# EAGLE design EspressoCircuitry (EAGLE 9.0.1)

## Sheet 1 of 3: Power and Embedded Control
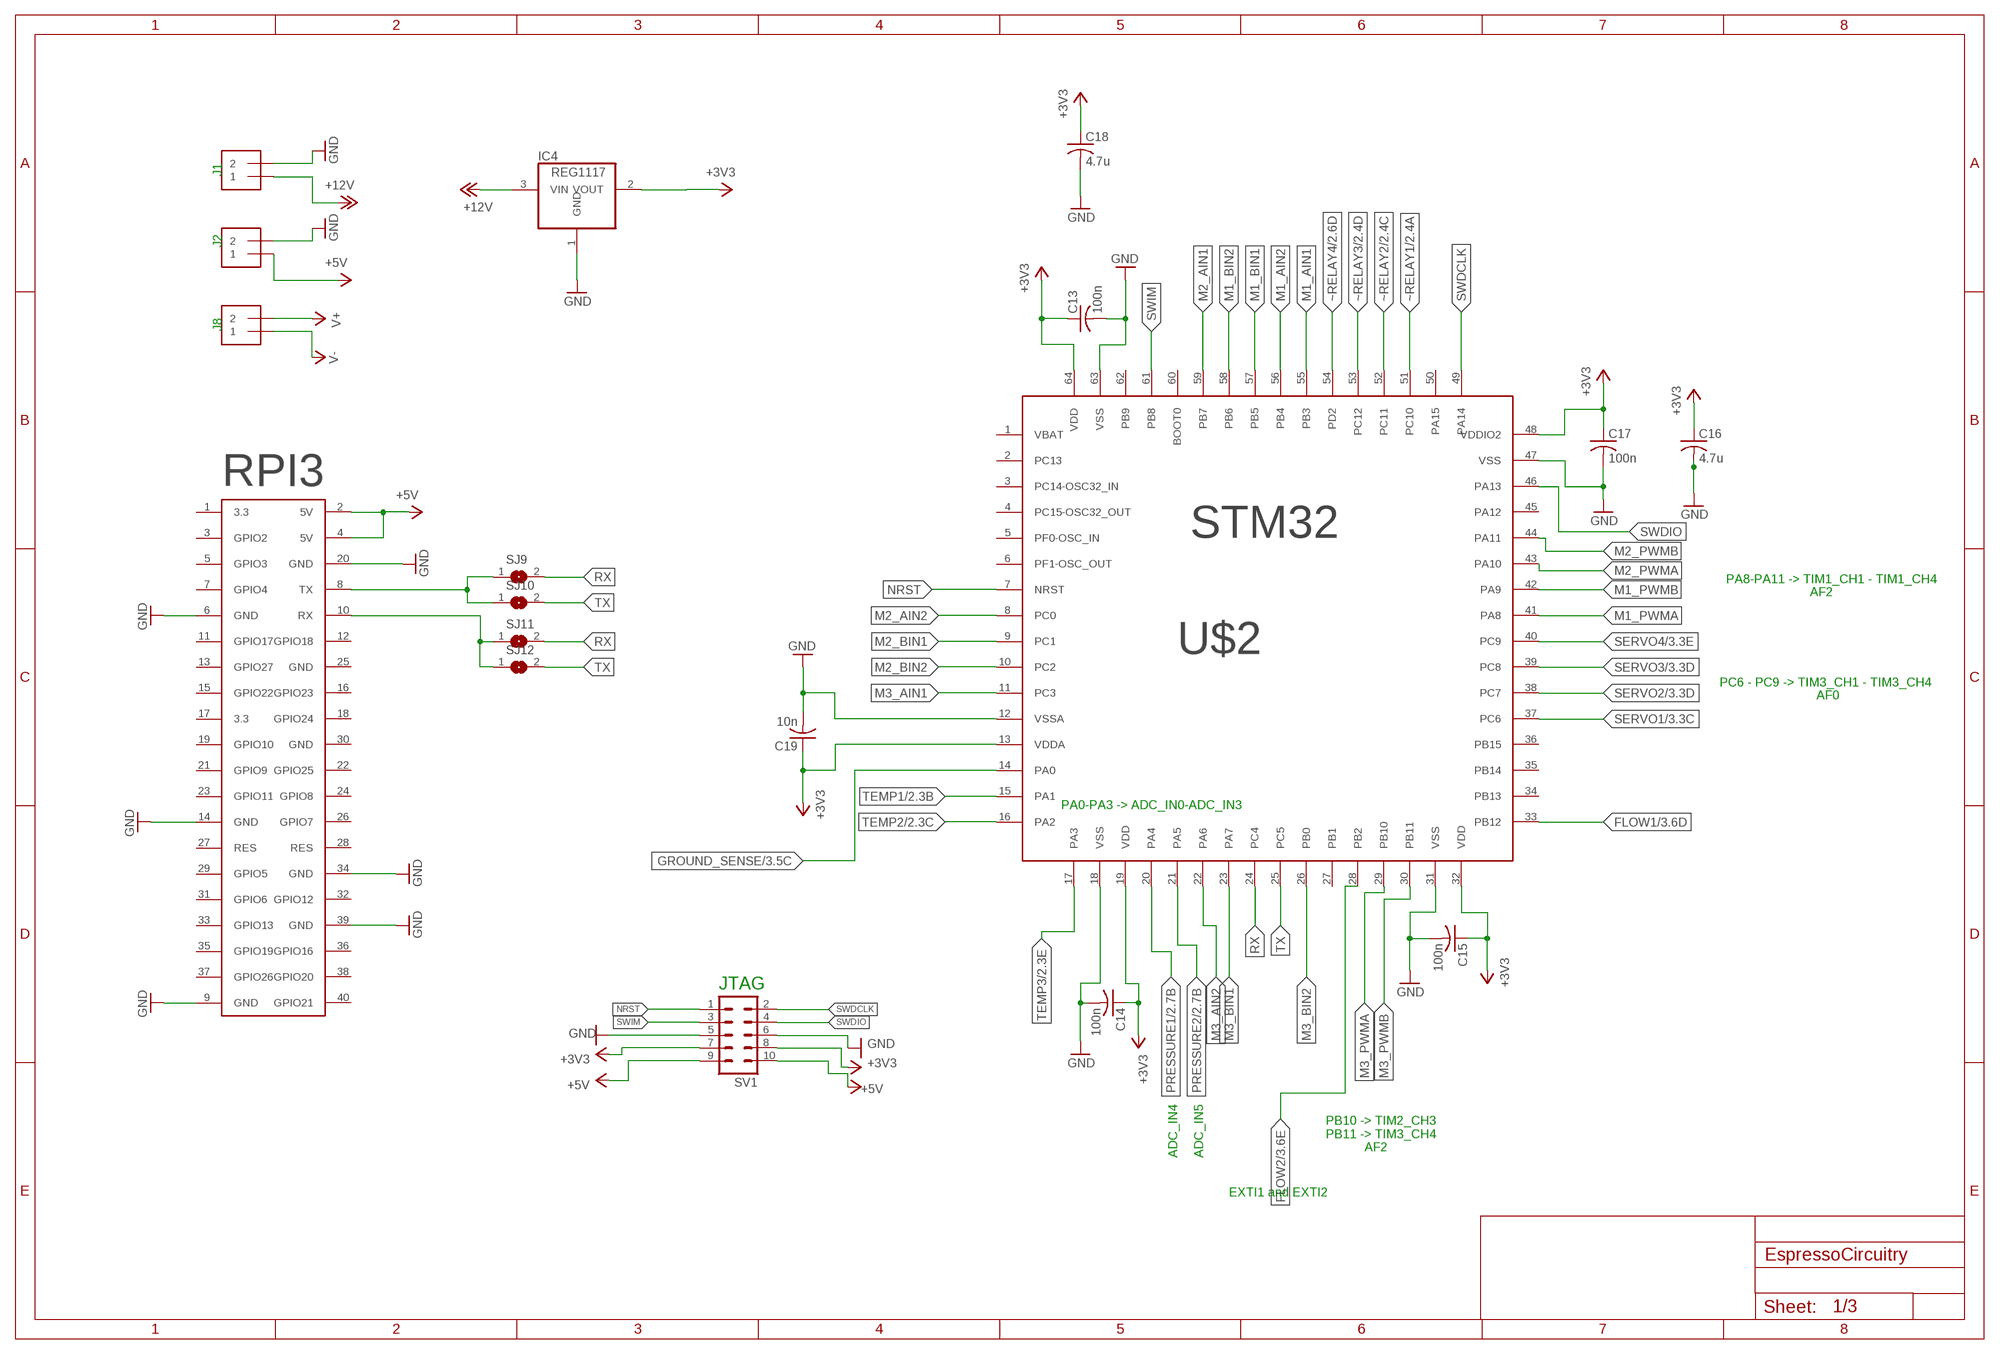
[diagram p0: schematic, sheet 1]

### Parts
C13  100n  C-USC0603  [C0603]
C14  100n  C-USC0603  [C0603]
C15  100n  C-USC0603  [C0603]
C16  4.7u  C-USC0603  [C0603]
C17  100n  C-USC0603  [C0603]
C18  4.7u  C-USC0603  [C0603]
C19  10n  C-USC0603  [C0603]
IC4  REG1117  [SOT223]
J1  1X2-3.5MM  [1X2-3.5MM]
J2  1X2-3.5MM  [1X2-3.5MM]
J8  1X2-3.5MM  [1X2-3.5MM]
SJ9  SJ  [SJ]
SJ10  SJ  [SJ]
SJ11  SJ  [SJ]
SJ12  SJ  [SJ]
SV1  MA05-2  [MA05-2]
U$1  RPI  [FE20-2]
U$2  STM32F072RBT6LGFP64  [PLQFP64-1]

### Nets
+3V3: C13.1 C14.1 C15.1 C16.1 C17.1 C18.1 C19.1 IC4.2(VOUT) SV1.7 SV1.8 U$2.13(VDDA) U$2.19(VDD) U$2.32(VDD) U$2.48(VDDIO2) U$2.64(VDD) ; also sheet 2,3
+5V: J2.1 SV1.9 SV1.10 U$1.2(5V) U$1.4(5V) ; also sheet 2,3
+12V: IC4.3(VIN) J1.1 ; also sheet 2,3
FLOW1: U$2.33(PB12) ; also sheet 3
FLOW2: U$2.28(PB2) ; also sheet 3
GND: C13.2 C14.2 C15.2 C16.2 C17.2 C18.2 C19.2 IC4.1(GND) J1.2 J2.2 SV1.5 SV1.6 U$1.6(GND) U$1.9(GND) U$1.14(GND) U$1.20(GND) U$1.34(GND) U$1.39(GND) U$2.12(VSSA) U$2.18(VSS) U$2.31(VSS) U$2.47(VSS) U$2.63(VSS) ; also sheet 2,3
GROUND_SENSE: U$2.14(PA0) ; also sheet 3
M1_AIN1: U$2.55(PB3) ; also sheet 3
M1_AIN2: U$2.56(PB4) ; also sheet 3
M1_BIN1: U$2.57(PB5) ; also sheet 3
M1_BIN2: U$2.58(PB6) ; also sheet 3
M1_PWMA: U$2.41(PA8) ; also sheet 3
M1_PWMB: U$2.42(PA9) ; also sheet 3
M2_AIN1: U$2.59(PB7) ; also sheet 3
M2_AIN2: U$2.8(PC0) ; also sheet 3
M2_BIN1: U$2.9(PC1) ; also sheet 3
M2_BIN2: U$2.10(PC2) ; also sheet 3
M2_PWMA: U$2.43(PA10) ; also sheet 3
M2_PWMB: U$2.44(PA11) ; also sheet 3
M3_AIN1: U$2.11(PC3) ; also sheet 3
M3_AIN2: U$2.22(PA6) ; also sheet 3
M3_BIN1: U$2.23(PA7) ; also sheet 3
M3_BIN2: U$2.26(PB0) ; also sheet 3
M3_PWMA: U$2.29(PB10) ; also sheet 3
M3_PWMB: U$2.30(PB11) ; also sheet 3
N$1: SJ9.1 SJ10.1 U$1.8(TX)
N$48: SJ11.1 SJ12.1 U$1.10(RX)
NRST: SV1.1 U$2.7(NRST)
PRESSURE1: U$2.20(PA4) ; also sheet 2
PRESSURE2: U$2.21(PA5) ; also sheet 2
RX: SJ9.2 SJ11.2 U$2.24(PC4)
SERVO1: U$2.37(PC6) ; also sheet 3
SERVO2: U$2.38(PC7) ; also sheet 3
SERVO3: U$2.39(PC8) ; also sheet 3
SERVO4: U$2.40(PC9) ; also sheet 3
SWDCLK: SV1.2 U$2.49(PA14)
SWDIO: SV1.4 U$2.46(PA13)
SWIM: SV1.3 U$2.61(PB8)
TEMP1: U$2.15(PA1) ; also sheet 2
TEMP2: U$2.16(PA2) ; also sheet 2
TEMP3: U$2.17(PA3) ; also sheet 2
TX: SJ10.2 SJ12.2 U$2.25(PC5)
V+: J8.2 ; also sheet 2
V-: J8.1 ; also sheet 2
~RELAY1: U$2.51(PC10) ; also sheet 2
~RELAY2: U$2.52(PC11) ; also sheet 2
~RELAY3: U$2.53(PC12) ; also sheet 2
~RELAY4: U$2.54(PD2) ; also sheet 2
Unconnected: U$1.1(3.3) U$1.3(GPIO2) U$1.5(GPIO3) U$1.7(GPIO4) U$1.11(GPIO17) U$1.12(GPIO18) U$1.13(GPIO27) U$1.15(GPIO22) U$1.16(GPIO23) U$1.17(3.3) U$1.18(GPIO24) U$1.19(GPIO10) U$1.21(GPIO9) U$1.22(GPIO25) U$1.23(GPIO11) U$1.24(GPIO8) U$1.25(GND) U$1.26(GPIO7) U$1.27(RES) U$1.28(RES) U$1.29(GPIO5) U$1.30(GND) U$1.31(GPIO6) U$1.32(GPIO12) U$1.33(GPIO13) U$1.35(GPIO19) U$1.36(GPIO16) U$1.37(GPIO26) U$1.38(GPIO20) U$1.40(GPIO21) U$2.1(VBAT) U$2.2(PC13) U$2.3(PC14-OSC32_IN) U$2.4(PC15-OSC32_OUT) U$2.5(PF0-OSC_IN) U$2.6(PF1-OSC_OUT) U$2.27(PB1) U$2.34(PB13) U$2.35(PB14) U$2.36(PB15) U$2.45(PA12) U$2.50(PA15) U$2.60(BOOT0) U$2.62(PB9)

### Notes on the sheet
- J1
- J2
- J8
- PA8-PA11 -> TIM1_CH1 - TIM1_CH4
- AF2
- PC6 - PC9 -> TIM3_CH1 - TIM3_CH4
- AF0
- PA0-PA3 -> ADC_IN0-ADC_IN3
- JTAG
- PB10 -> TIM2_CH3
  PB11 -> TIM3_CH4
- AF2
- ADC_IN4 | ADC_IN5
- EXTI1 and EXTI2

## Sheet 2 of 3: Thermal Management
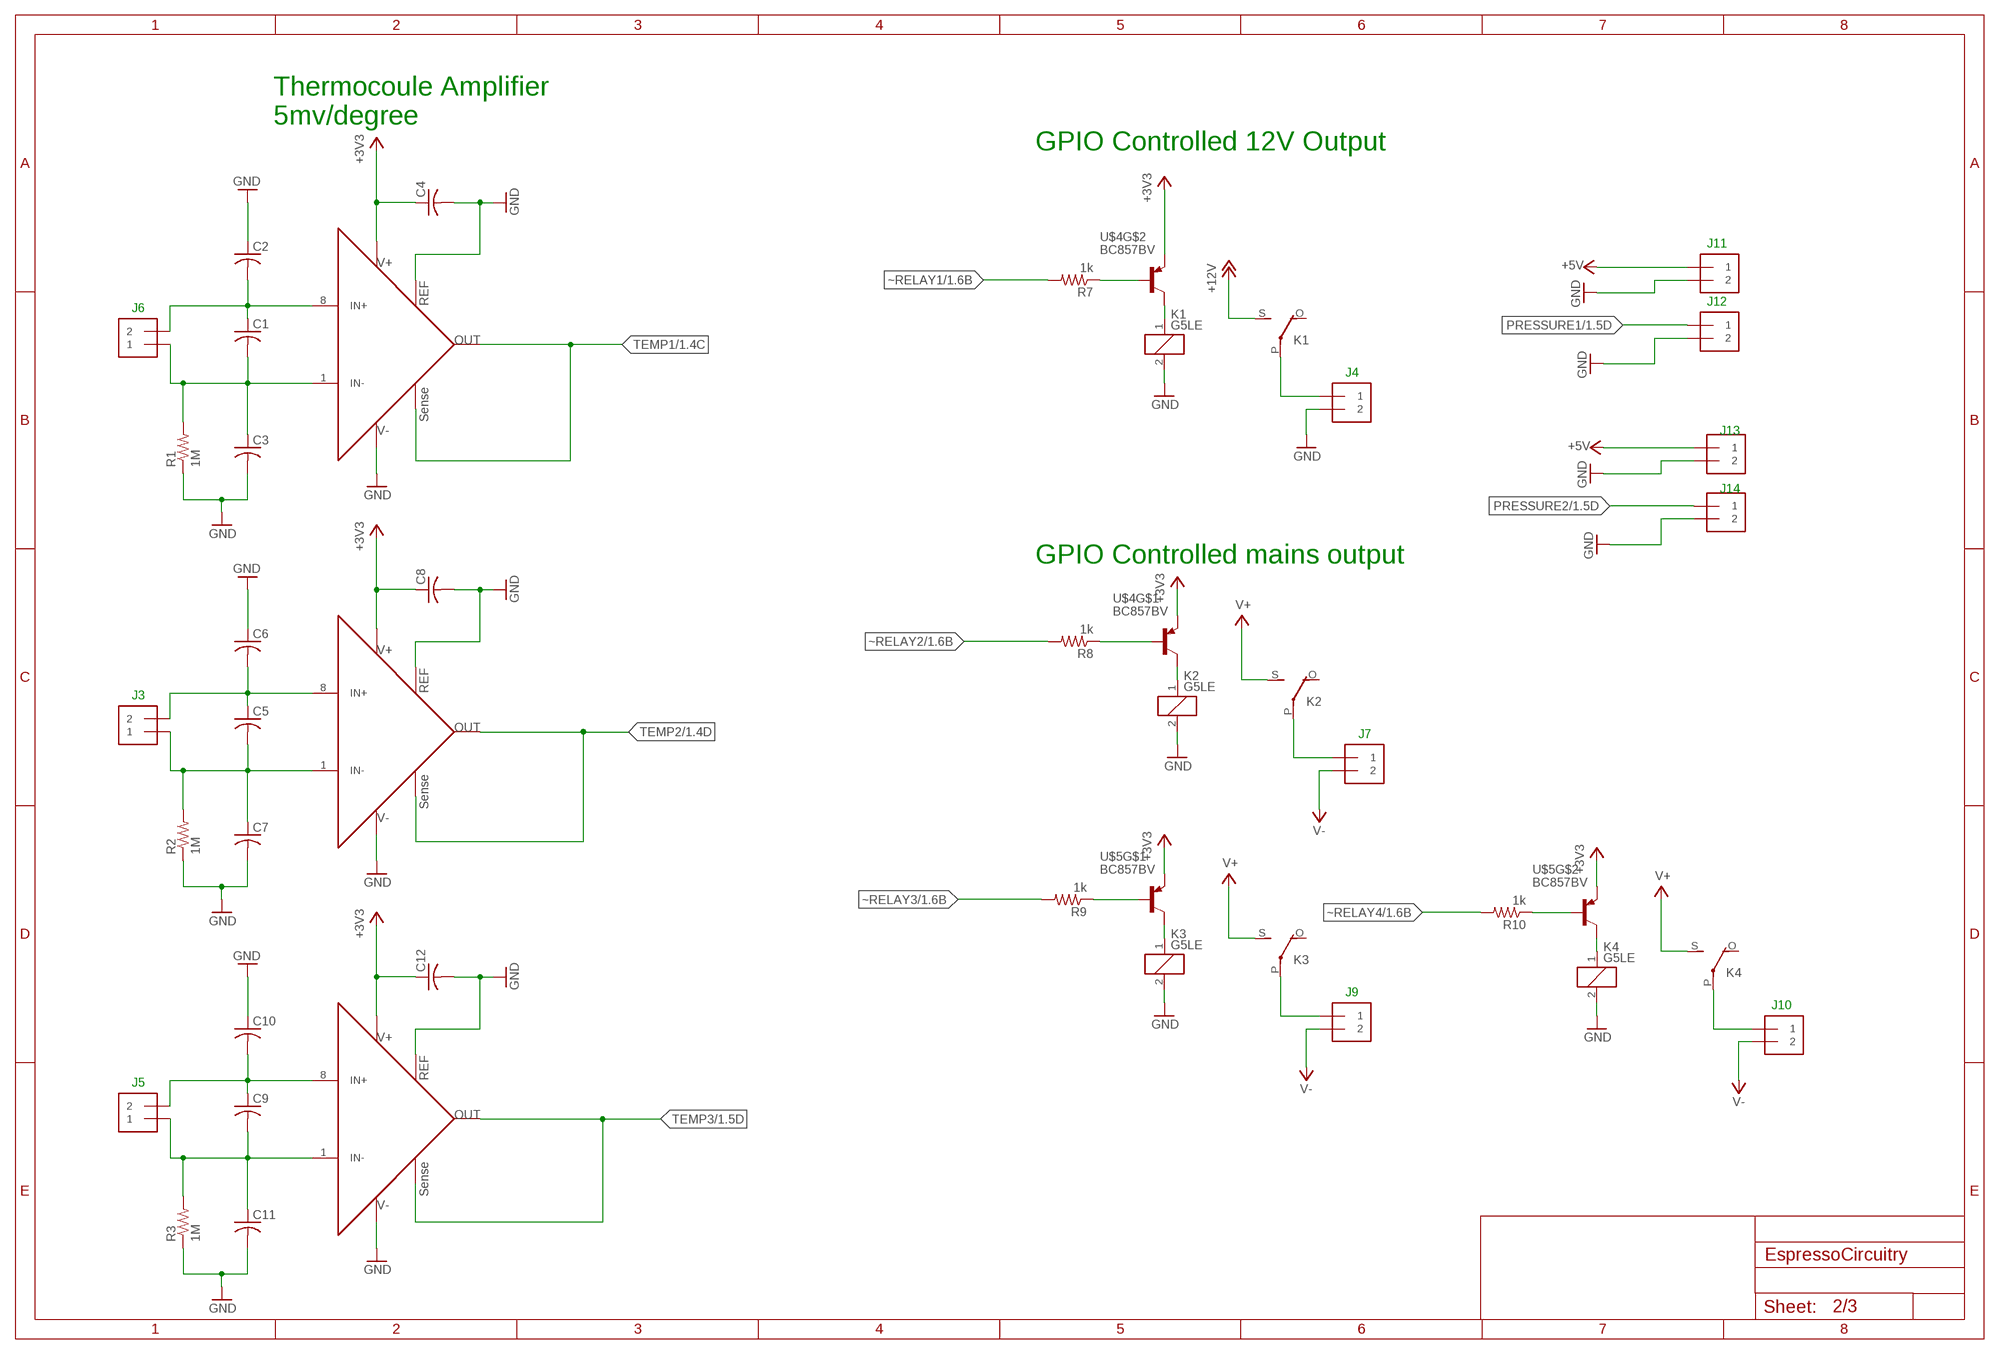
[diagram p1: schematic, sheet 2]

### Parts
C1  C-USC0603  [C0603]
C2  C-USC0603  [C0603]
C3  C-USC0603  [C0603]
C4  C-USC0603  [C0603]
C5  C-USC0603  [C0603]
C6  C-USC0603  [C0603]
C7  C-USC0603  [C0603]
C8  C-USC0603  [C0603]
C9  C-USC0603  [C0603]
C10  C-USC0603  [C0603]
C11  C-USC0603  [C0603]
C12  C-USC0603  [C0603]
J3  1X2-3.5MM  [1X2-3.5MM]
J4  1X2-3.5MM  [1X2-3.5MM]
J5  1X2-3.5MM  [1X2-3.5MM]
J6  1X2-3.5MM  [1X2-3.5MM]
J7  1X2-3.5MM  [1X2-3.5MM]
J9  1X2-3.5MM  [1X2-3.5MM]
J10  1X2-3.5MM  [1X2-3.5MM]
J11  1X2-3.5MM  [1X2-3.5MM]
J12  1X2-3.5MM  [1X2-3.5MM]
J13  1X2-3.5MM  [1X2-3.5MM]
J14  1X2-3.5MM  [1X2-3.5MM]
K1  G5LE  [G5LE]
K2  G5LE  [G5LE]
K3  G5LE  [G5LE]
K4  G5LE  [G5LE]
R1  1M  R-US_R0603  [R0603]
R2  1M  R-US_R0603  [R0603]
R3  1M  R-US_R0603  [R0603]
R7  1k  R-US_R0603  [R0603]
R8  1k  R-US_R0603  [R0603]
R9  1k  R-US_R0603  [R0603]
R10  1k  R-US_R0603  [R0603]
U$3  AD8494  [TSSOP8]
U$4  BC857BV  [SOT-563]
U$5  BC857BV  [SOT-563]
U$6  AD8494  [TSSOP8]
U$7  AD8494  [TSSOP8]

### Nets
+3V3: C4.1 C8.1 C12.1 U$3.7(V+) U$4.P$3(E) U$4.P$6(E) U$5.P$3(E) U$5.P$6(E) U$6.7(V+) U$7.7(V+) ; also sheet 1,3
+5V: J11.1 J13.1 ; also sheet 1,3
+12V: K1.S(2:S) ; also sheet 1,3
GND: C2.1 C3.2 C4.2 C6.1 C7.2 C8.2 C10.1 C11.2 C12.2 J4.2 J11.2 J12.2 J13.2 J14.2 K1.2 K2.2 K3.2 K4.2 R1.1 R2.1 R3.1 U$3.2(REF) U$3.3(V-) U$6.2(REF) U$6.3(V-) U$7.2(REF) U$7.3(V-) ; also sheet 1,3
N$2: J4.1 K1.P(2:P)
N$3: J7.1 K2.P(2:P)
N$4: K1.1 U$4.P$1(C)
N$5: K2.1 U$4.P$4(C)
N$6: C1.1 C2.2 J6.2 U$3.8(IN+)
N$7: C1.2 C3.1 J6.1 R1.2 U$3.1(IN-)
N$8: J9.1 K3.P(2:P)
N$9: K3.1 U$5.P$4(C)
N$10: C5.1 C6.2 J3.2 U$6.8(IN+)
N$11: C5.2 C7.1 J3.1 R2.2 U$6.1(IN-)
N$12: C9.1 C10.2 J5.2 U$7.8(IN+)
N$13: C9.2 C11.1 J5.1 R3.2 U$7.1(IN-)
N$16: J10.1 K4.P(2:P)
N$17: K4.1 U$5.P$1(C)
N$40: R7.1 U$4.P$2(B)
N$41: R8.1 U$4.P$5(B)
N$42: R9.1 U$5.P$5(B)
N$43: R10.1 U$5.P$2(B)
PRESSURE1: J12.1 ; also sheet 1
PRESSURE2: J14.1 ; also sheet 1
TEMP1: U$3.5(SENSE) U$3.6(OUT) ; also sheet 1
TEMP2: U$6.5(SENSE) U$6.6(OUT) ; also sheet 1
TEMP3: U$7.5(SENSE) U$7.6(OUT) ; also sheet 1
V+: K2.S(2:S) K3.S(2:S) K4.S(2:S) ; also sheet 1
V-: J7.2 J9.2 J10.2 ; also sheet 1
~RELAY1: R7.2 ; also sheet 1
~RELAY2: R8.2 ; also sheet 1
~RELAY3: R9.2 ; also sheet 1
~RELAY4: R10.2 ; also sheet 1
Unconnected: K1.O(2:O) K2.O(2:O) K3.O(2:O) K4.O(2:O)

### Notes on the sheet
- Thermocoule Amplifier
  5mv/degree
- GPIO Controlled 12V Output
- J11
- J12
- J6
- J4
- J13
- J14
- GPIO Controlled mains output
- J3
- J7
- J9
- J10
- J5

## Sheet 3 of 3: Mechanical Control
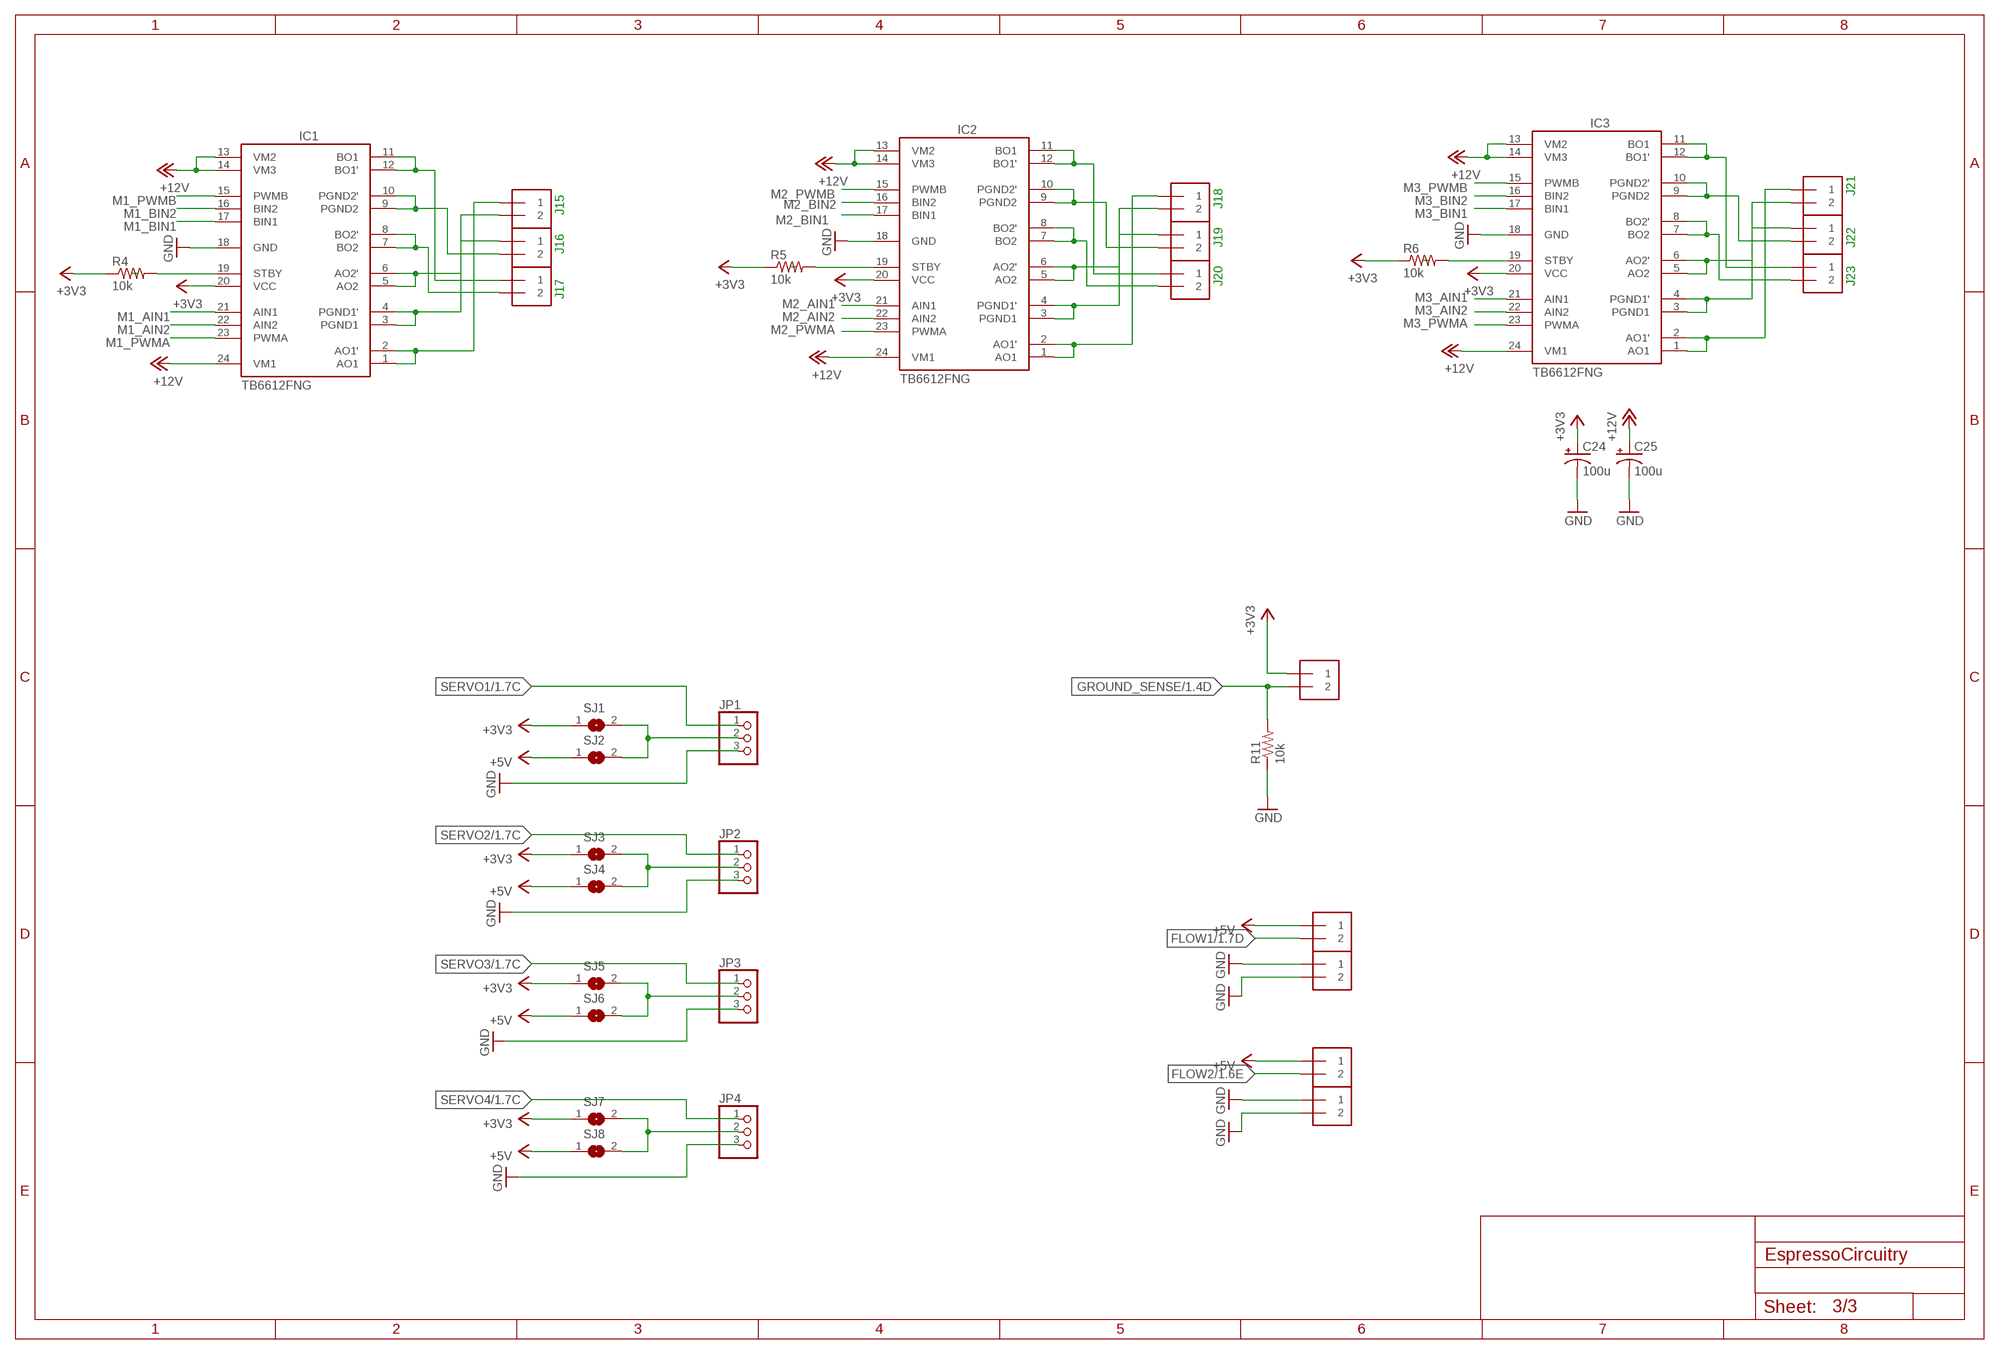
[diagram p2: schematic, sheet 3]

### Parts
C24  100u  CPOL-USE2.5-5  [E2,5-5]
C25  100u  CPOL-USE2.5-5  [E2,5-5]
IC1  TB6612FNG  [SSOP24]
IC2  TB6612FNG  [SSOP24]
IC3  TB6612FNG  [SSOP24]
J15  1X2-3.5MM  [1X2-3.5MM]
J16  1X2-3.5MM  [1X2-3.5MM]
J17  1X2-3.5MM  [1X2-3.5MM]
J18  1X2-3.5MM  [1X2-3.5MM]
J19  1X2-3.5MM  [1X2-3.5MM]
J20  1X2-3.5MM  [1X2-3.5MM]
J21  1X2-3.5MM  [1X2-3.5MM]
J22  1X2-3.5MM  [1X2-3.5MM]
J23  1X2-3.5MM  [1X2-3.5MM]
J24  1X2-3.5MM  [1X2-3.5MM]
J25  1X2-3.5MM  [1X2-3.5MM]
J26  1X2-3.5MM  [1X2-3.5MM]
J27  1X2-3.5MM  [1X2-3.5MM]
J28  1X2-3.5MM  [1X2-3.5MM]
JP1  PINHD-1X3  [1X03]
JP2  PINHD-1X3  [1X03]
JP3  PINHD-1X3  [1X03]
JP4  PINHD-1X3  [1X03]
R4  10k  R-US_R0603  [R0603]
R5  10k  R-US_R0603  [R0603]
R6  10k  R-US_R0603  [R0603]
R11  10k  R-US_R0603  [R0603]
SJ1  SJ  [SJ]
SJ2  SJ  [SJ]
SJ3  SJ  [SJ]
SJ4  SJ  [SJ]
SJ5  SJ  [SJ]
SJ6  SJ  [SJ]
SJ7  SJ  [SJ]
SJ8  SJ  [SJ]

### Nets
+3V3: C24.+ IC1.20(VCC) IC2.20(VCC) IC3.20(VCC) J24.1 R4.1 R5.1 R6.1 SJ1.1 SJ3.1 SJ5.1 SJ7.1 ; also sheet 1,2
+5V: J25.1 J27.1 SJ2.1 SJ4.1 SJ6.1 SJ8.1 ; also sheet 1,2
+12V: C25.+ IC1.13(VM2) IC1.14(VM3) IC1.24(VM1) IC2.13(VM2) IC2.14(VM3) IC2.24(VM1) IC3.13(VM2) IC3.14(VM3) IC3.24(VM1) ; also sheet 1,2
FLOW1: J25.2 ; also sheet 1
FLOW2: J27.2 ; also sheet 1
GND: C24.- C25.- IC1.18(GND) IC2.18(GND) IC3.18(GND) J26.1 J26.2 J28.1 J28.2 JP1.3 JP2.3 JP3.3 JP4.3 R11.1 ; also sheet 1,2
GROUND_SENSE: J24.2 R11.2 ; also sheet 1
M1_AIN1: IC1.21(AIN1) ; also sheet 1
M1_AIN2: IC1.22(AIN2) ; also sheet 1
M1_BIN1: IC1.17(BIN1) ; also sheet 1
M1_BIN2: IC1.16(BIN2) ; also sheet 1
M1_PWMA: IC1.23(PWMA) ; also sheet 1
M1_PWMB: IC1.15(PWMB) ; also sheet 1
M2_AIN1: IC2.21(AIN1) ; also sheet 1
M2_AIN2: IC2.22(AIN2) ; also sheet 1
M2_BIN1: IC2.17(BIN1) ; also sheet 1
M2_BIN2: IC2.16(BIN2) ; also sheet 1
M2_PWMA: IC2.23(PWMA) ; also sheet 1
M2_PWMB: IC2.15(PWMB) ; also sheet 1
M3_AIN1: IC3.21(AIN1) ; also sheet 1
M3_AIN2: IC3.22(AIN2) ; also sheet 1
M3_BIN1: IC3.17(BIN1) ; also sheet 1
M3_BIN2: IC3.16(BIN2) ; also sheet 1
M3_PWMA: IC3.23(PWMA) ; also sheet 1
M3_PWMB: IC3.15(PWMB) ; also sheet 1
N$14: IC1.1(AO1) IC1.2(AO1') J15.1
N$15: IC1.3(PGND1) IC1.4(PGND1') J16.1
N$18: IC1.5(AO2) IC1.6(AO2') J15.2
N$19: IC1.7(BO2) IC1.8(BO2') J17.2
N$20: IC1.9(PGND2) IC1.10(PGND2') J16.2
N$21: IC1.11(BO1) IC1.12(BO1') J17.1
N$22: IC1.19(STBY) R4.2
N$24: IC2.1(AO1) IC2.2(AO1') J18.1
N$25: IC2.3(PGND1) IC2.4(PGND1') J19.1
N$26: IC2.5(AO2) IC2.6(AO2') J18.2
N$27: IC2.7(BO2) IC2.8(BO2') J20.2
N$28: IC2.9(PGND2) IC2.10(PGND2') J19.2
N$29: IC2.11(BO1) IC2.12(BO1') J20.1
N$30: IC2.19(STBY) R5.2
N$32: IC3.1(AO1) IC3.2(AO1') J21.1
N$33: IC3.3(PGND1) IC3.4(PGND1') J22.1
N$34: IC3.5(AO2) IC3.6(AO2') J21.2
N$35: IC3.7(BO2) IC3.8(BO2') J23.2
N$36: IC3.9(PGND2) IC3.10(PGND2') J22.2
N$37: IC3.11(BO1) IC3.12(BO1') J23.1
N$38: IC3.19(STBY) R6.2
N$44: JP1.2 SJ1.2 SJ2.2
N$45: JP2.2 SJ3.2 SJ4.2
N$46: JP3.2 SJ5.2 SJ6.2
N$47: JP4.2 SJ7.2 SJ8.2
SERVO1: JP1.1 ; also sheet 1
SERVO2: JP2.1 ; also sheet 1
SERVO3: JP3.1 ; also sheet 1
SERVO4: JP4.1 ; also sheet 1

### Notes on the sheet
- J21
- J18
- J15
- J19 | J22
- J16
- J20 | J23
- J17

## Library data of the parts
C1-C19 = rcl:C-US: CAPACITOR, American symbol; SPICEPREFIX: C
C24 C25 = rcl:CPOL-US: POLARIZED CAPACITOR, American symbol; SPICEPREFIX: C
IC1-IC3 = adafruit:TB6612FNG: TB6612FNG MOS dual H-bridge motor driver, 1.2A current 3.2A peak 3 or 5v logic and 3-15v motor
IC4 = burr-brown:REG1117: 800mA and 1A Low Dropout (LDO) Positive Regulator 1.8V, 2.5V, 2.85V, 3.3V, 5V, and Adj; MPN: REG1117; OC_FARNELL: 1097566; OC_NEWARK: 14P6981
J1-J28 = adafruit:1X2: 3.5mm Terminal block http://www.ladyada.net/library/pcb/eaglelibrary.html
JP1-JP4 = adafruit:PINHD-1X3: PIN HEADER
K1-K4 = relay:G5LE: RELAY 1 x switch, 10 A/120 V AC, 8 A/30 V DC, Omron; OC_FARNELL: unknown; OC_NEWARK: unknown
R1-R11 = rcl:R-US_: RESISTOR, American symbol; SPICEPREFIX: R
SJ1-SJ12 = jumper:SJ: SMD solder JUMPER
SV1 = con-lstb:MA05-2: PIN HEADER; OC_FARNELL: unknown; OC_NEWARK: unknown
U$1 = EspressoParts:RPI
U$2 = EspressoParts:STM32F072RBT6
U$3 U$6 U$7 = EspressoParts:AD8494
U$4 U$5 = EspressoParts:BC857BV

## Board
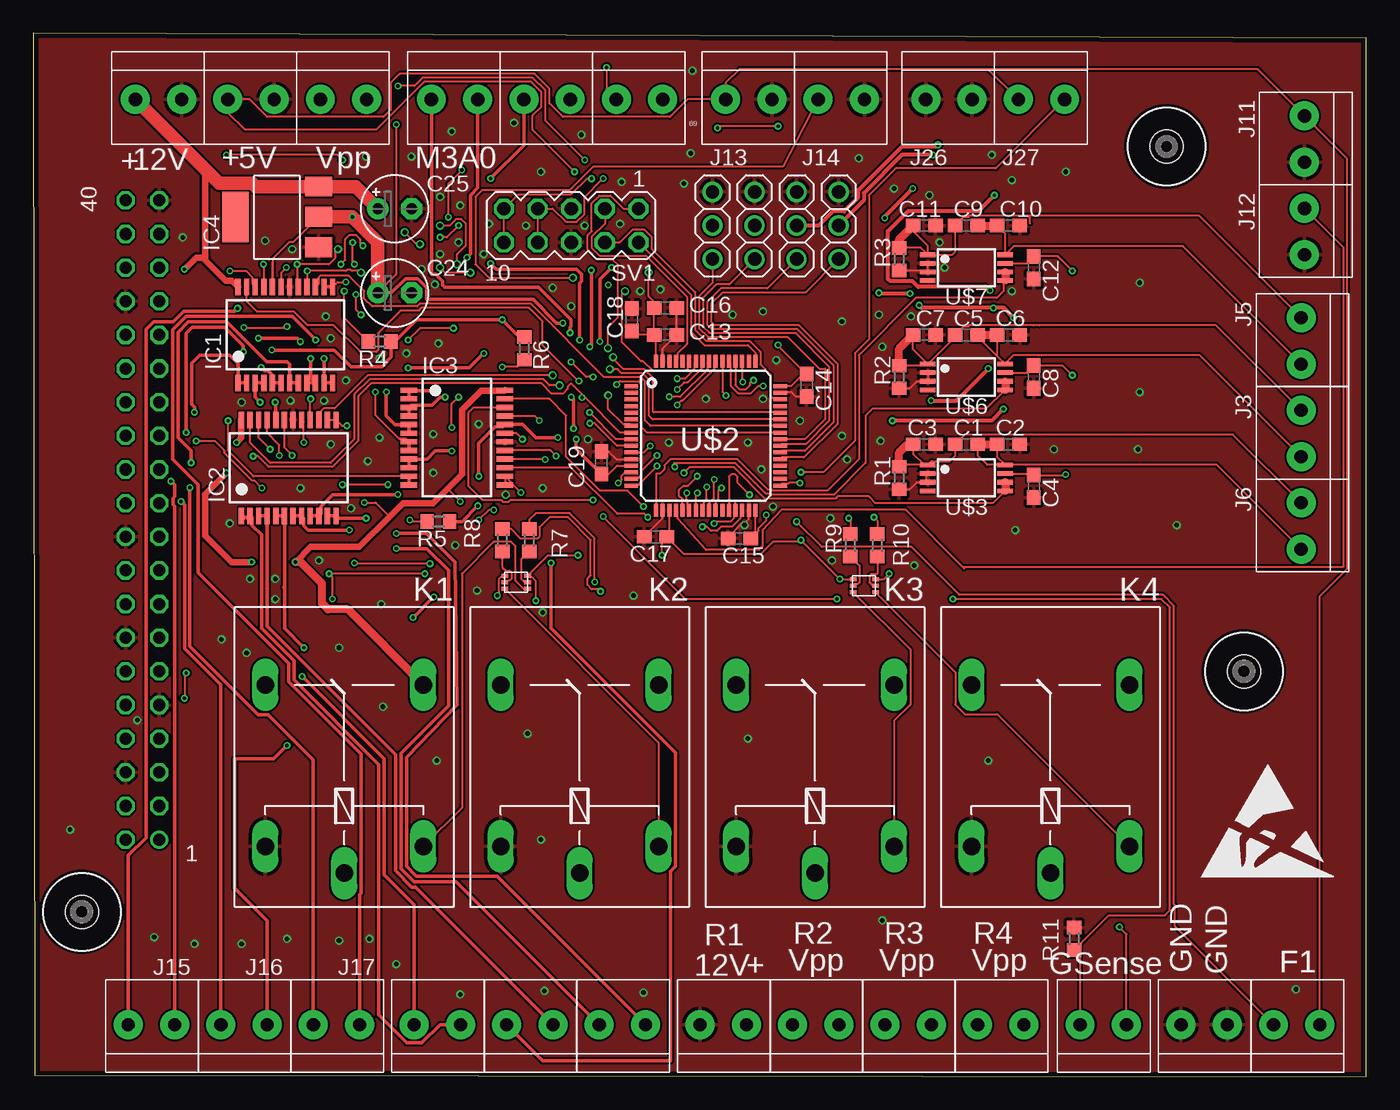
[diagram p3: board, top side]
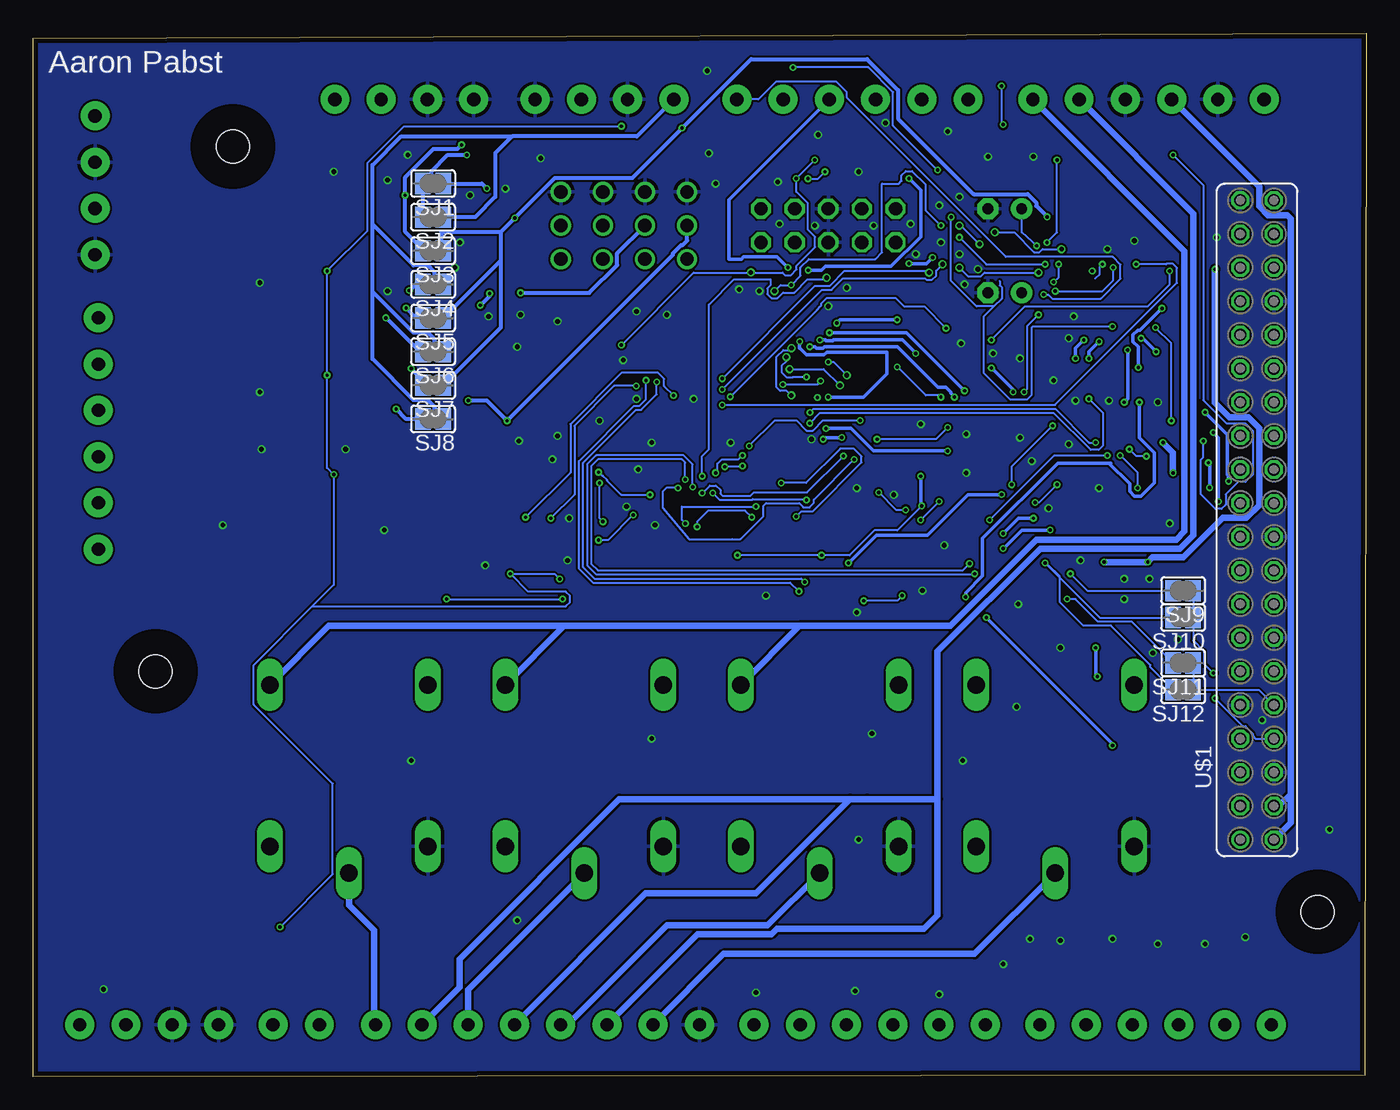
[diagram p4: board, bottom side, seen from below]

Size 100.69 x 78.79 mm. Coordinates in mm from the lower left corner, seen from the top.
Outline: 0.13,0.13 100.69,0 100.69,78.41 0,78.79 0.13,0.13
Copper layers (1*16): Top 0.035559375mm / dielectric 1.6mm / Bottom 0.035559375mm
Design rules "oshpark-2layer": minimum track width 6mil, minimum drill 10mil, track to track 6mil, track to pad 6mil, pad to pad 6mil, via to via 6mil, smd to smd 6mil, copper to edge 15mil, drill to drill 6mil, minimum pad ring 5mil, minimum via ring 5mil, stop-mask expansion 2.5mil, vias tented up to drill 0mil, thermal gap 10mil

### Footprints (pad centres in the part's own frame; a part is rotated, then mirrored left to right if it is on the bottom)
C0603 = smd 1.1 x 1: 1 -0.85,0; 2 0.85,0
E2,5-5 = drill 0.813 pad 1.6: + -1.27,0 | drill 0.813 pad 1.6 octagon: - 1.27,0
SSOP24 = smd 0.4 x 1.25: 1 -3.575,-3.625; 2 -2.925,-3.625; 3 -2.275,-3.625; 4 -1.625,-3.625; 5 -0.975,-3.625; 6 -0.325,-3.625; 7 0.325,-3.625; 8 0.975,-3.625; 9 1.625,-3.625; 10 2.275,-3.625; 11 2.925,-3.625; 12 3.575,-3.625; 13 3.575,3.625; 14 2.925,3.625; 15 2.275,3.625; 16 1.625,3.625; 17 0.975,3.625; 18 0.325,3.625; 19 -0.325,3.625; 20 -0.975,3.625; 21 -1.625,3.625; 22 -2.275,3.625; 23 -2.925,3.625; 24 -3.575,3.625
SOT223 = smd 1.499 x 2.007: 1 -2.261,-3.15; 2 0.025,-3.15; 3 2.311,-3.15 | smd 3.81 x 2.007: 4 0,3.15
1X2-3.5MM = drill 1 pad 2.184: 1 1.8,0; 2 -1.7,0
1X03 = drill 1.016: 1 -2.54,0; 2 0,0; 3 2.54,0
G5LE = drill 1.321 long: 1 -7.493,-5.969; 2 -7.493,5.969; O 4.699,5.969; P -9.525,0; S 4.699,-5.969
R0603 = smd 1 x 1.1: 1 -0.85,0; 2 0.85,0
SJ = smd 1.168 x 1.6: 1 -0.762,0; 2 0.762,0
MA05-2 = drill 1.016 octagon: 1 -5.08,-1.27; 2 -5.08,1.27; 3 -2.54,-1.27; 4 -2.54,1.27; 5 0,-1.27; 6 0,1.27; 7 2.54,-1.27; 8 2.54,1.27; 9 5.08,-1.27; 10 5.08,1.27
FE20-2 = drill 0.914: 1 -13.97,12.7 | drill 0.914 octagon: 2 -11.43,12.7; 3 -13.97,10.16; 4 -11.43,10.16; 5 -13.97,7.62; 6 -11.43,7.62; 7 -13.97,5.08; 8 -11.43,5.08; 9 -13.97,2.54; 10 -11.43,2.54; 11 -13.97,0; 12 -11.43,0; 13 -13.97,-2.54; 14 -11.43,-2.54; 15 -13.97,-5.08; 16 -11.43,-5.08; 17 -13.97,-7.62; 18 -11.43,-7.62; 19 -13.97,-10.16; 20 -11.43,-10.16; 21 -13.97,-12.7; 22 -11.43,-12.7; 23 -13.97,-15.24; 24 -11.43,-15.24; 25 -13.97,-17.78; 26 -11.43,-17.78; 27 -13.97,-20.32; 28 -11.43,-20.32; 29 -13.97,-22.86; 30 -11.43,-22.86; 31 -13.97,-25.4; 32 -11.43,-25.4; 33 -13.97,-27.94; 34 -11.43,-27.94; 35 -13.97,-30.48; 36 -11.43,-30.48; 37 -13.97,-33.02; 38 -11.43,-33.02; 39 -13.97,-35.56; 40 -11.43,-35.56
PLQFP64-1 = smd 1 x 0.3: 1 -5.625,3.75; 2 -5.625,3.25; 3 -5.625,2.75; 4 -5.625,2.25; 5 -5.625,1.75; 6 -5.625,1.25; 7 -5.625,0.75; 8 -5.625,0.25; 9 -5.625,-0.25; 10 -5.625,-0.75; 11 -5.625,-1.25; 12 -5.625,-1.75; 13 -5.625,-2.25; 14 -5.625,-2.75; 15 -5.625,-3.25; 16 -5.625,-3.75; 33 5.625,-3.75; 34 5.625,-3.25; 35 5.625,-2.75; 36 5.625,-2.25; 37 5.625,-1.75; 38 5.625,-1.25; 39 5.625,-0.75; 40 5.625,-0.25; 41 5.625,0.25; 42 5.625,0.75; 43 5.625,1.25; 44 5.625,1.75; 45 5.625,2.25; 46 5.625,2.75; 47 5.625,3.25; 48 5.625,3.75 | smd 0.3 x 1: 17 -3.75,-5.625; 18 -3.25,-5.625; 19 -2.75,-5.625; 20 -2.25,-5.625; 21 -1.75,-5.625; 22 -1.25,-5.625; 23 -0.75,-5.625; 24 -0.25,-5.625; 25 0.25,-5.625; 26 0.75,-5.625; 27 1.25,-5.625; 28 1.75,-5.625; 29 2.25,-5.625; 30 2.75,-5.625; 31 3.25,-5.625; 32 3.75,-5.625; 49 3.75,5.625; 50 3.25,5.625; 51 2.75,5.625; 52 2.25,5.625; 53 1.75,5.625; 54 1.25,5.625; 55 0.75,5.625; 56 0.25,5.625; 57 -0.25,5.625; 58 -0.75,5.625; 59 -1.25,5.625; 60 -1.75,5.625; 61 -2.25,5.625; 62 -2.75,5.625; 63 -3.25,5.625; 64 -3.75,5.625
TSSOP8 = smd 1.2 x 0.35: 1 -2.925,0.975; 2 -2.925,0.325; 3 -2.925,-0.325; 4 -2.925,-0.975; 5 2.925,-0.975; 6 2.925,-0.325; 7 2.925,0.325; 8 2.925,0.975
SOT-563 = smd 0.3 x 0.5: P$1 0,0; P$2 0.5,0; P$3 1,0; P$4 0,1.7; P$5 0.5,1.7; P$6 1,1.7
DRIL-2,5 = hole 2.5: 0,0

### Placement (x,y rotation side)
C1  70.49,47.75 180 top
C2  73.66,47.75 180 top
C3  67.31,47.75 0 top
C4  75.56,44.58 270 top
C5  70.49,56.01 180 top
C6  73.66,56.01 180 top
C7  67.31,56.01 0 top
C8  75.56,52.83 270 top
C9  70.49,64.26 180 top
C10  73.66,64.26 180 top
C11  67.31,64.26 0 top
C12  75.56,61.09 270 top
C13  47.75,56.01 0 top
C14  58.42,52.2 270 top
C15  53.34,40.64 180 top
C16  47.75,58.04 0 top
C17  46.99,40.77 180 top
C18  45.21,57.15 90 top
C19  42.93,46.36 90 top
C24  27.3,59.18 0 top
C25  27.3,65.53 0 top
IC1  19.05,56.01 0 top
IC2  19.3,45.97 0 top
IC3  32,48.26 270 top
IC4  18.41,64.9 90 top
J1  9.53,73.79 180 top
J2  16.51,73.79 180 top
J3  95.76,48.51 90 top
J4  52.07,3.94 0 top
J5  95.76,55.5 90 top
J6  95.76,41.53 90 top
J7  59.05,3.94 0 top
J8  23.5,73.79 180 top
J9  66.04,3.94 0 top
J10  73.03,3.94 0 top
J11  96.01,70.74 90 top
J12  96.01,63.75 90 top
J13  54.1,73.79 180 top
J14  61.09,73.79 180 top
J15  8.89,3.94 0 top
J16  15.88,3.94 0 top
J17  22.86,3.94 0 top
J18  30.48,3.94 0 top
J19  37.47,3.94 0 top
J20  44.45,3.94 0 top
J21  31.88,73.79 180 top
J22  38.86,73.79 180 top
J23  45.85,73.79 180 top
J24  80.77,3.94 0 top
J25  95.38,3.94 0 top
J26  69.22,73.79 180 top
J27  76.2,73.79 180 top
J28  88.39,3.94 0 top
JP1  60.83,64.26 90 top
JP2  57.66,64.26 90 top
JP3  54.48,64.26 90 top
JP4  51.31,64.26 90 top
K1  23.5,24.89 90 top
K2  41.27,24.89 90 top
K3  59.05,24.89 90 top
K4  76.84,24.89 90 top
R1  65.41,45.21 90 top
R2  65.41,52.83 90 top
R3  65.41,61.72 90 top
R4  26.16,55.5 180 top
R5  30.61,41.91 180 top
R6  37.08,54.99 270 top
R7  37.47,40.51 90 top
R8  35.43,40.51 90 top
R9  61.72,40.13 90 top
R10  63.75,40.13 90 top
R11  78.61,10.41 270 top
SJ1  70.49,67.44 180 bottom
SJ2  70.49,64.9 180 bottom
SJ3  70.49,62.36 180 bottom
SJ4  70.49,59.82 180 bottom
SJ5  70.49,57.28 180 bottom
SJ6  70.49,54.74 180 bottom
SJ7  70.49,52.2 180 bottom
SJ8  70.49,49.66 180 bottom
SJ9  13.84,36.7 180 bottom
SJ10  13.84,34.67 180 bottom
SJ11  13.84,31.24 180 bottom
SJ12  13.84,29.21 180 bottom
SV1  40.64,64.26 180 top
U$1  -4.45,30.61 180 top
U$2  50.8,48.39 0 top
U$3  70.49,45.21 0 top
U$4  37.34,36.83 90 top
U$5  63.63,36.58 90 top
U$6  70.49,52.83 0 top
U$7  70.49,61.09 0 top
U$8  [ESD_10.00]  88.14,14.99 0 top
U$9  [DRIL-2,5]  91.44,30.61 0 top
U$10  [DRIL-2,5]  85.6,70.23 0 top
U$11  [DRIL-2,5]  3.68,12.45 0 top

### Tracks (layer width: path | path; a pad name or v marks a point on that pad's centre or on a via)
+3V3  (via drill 0.25, 0.35)
  Top 0.152: U$3.7 75.46,45.54 C4.1 77.94,45.43 v77.98,45.47 | U$6.7 75.04,53.16 C8.1 77.76,53.68 v78.49,52.96 | U$7.7 75.04,61.41 C12.1 77.38,61.94 v78.49,60.83 | C17.1 48.05,40.98 U$2.19 | U$2.32 54.55,41.13 C15.1 54.79,41.24 54.79,41.43 55.37,42.01 v55.37,42.42 | C19.1 43.47,45.51 44.1,46.14 U$2.13 | U$2.48 57.22,52.14 58.13,53.05 C14.1 56.26,55.21 v56.26,55.25 | U$2.64 47.05,55.86 C13.1 | C13.1 45.51,56.01 C18.1 | C13.1 C16.1 46.9,58.51 46.48,58.93 v46.48,60.73 | v43.05,67.82 41.63,66.4 41.63,65.12 41.05,64.54 40.23,64.54 39.24,65.53 SV1.7 SV1.8 | v27.56,74.8 28.79,74.8 29.4,75.41 37.73,75.41 38.69,74.46 38.69,72.18 v41.66,69.21 | v27.43,71.88 27.43,60.58 C24.+ | v57.99,40.51 58.08,40.42 | 58.08,40.42 v60.92,37.58 U$5.P$6 | U$5.P$3 64.25,37.58 v64.64,37.97 | 58.08,40.42 55.91,40.42 54.96,39.48 50.92,39.48 50.91,39.47 50.79,39.48 49.13,39.48 C17.1 | J24.1 82.57,10.77 v82.04,11.3 | v47.5,39.37 47.5,40.43 C17.1 | U$4.P$3 37.41,37.9 | 37.41,37.9 38.88,39.37 v41.15,39.37 | v35.05,36.32 35.16,36.43 35.16,37.58 35.29,37.71 35.52,37.71 U$4.P$6 | 37.41,37.9 37.6,37.71 37.68,37.71 37.97,37.42 v37.97,35.94 | v56.26,71.75 51.82,71.75 v51.69,71.62 | IC4.2 19.66,63.02 19.34,63.02 18.08,61.75 18.08,61.34
  Top 0.203: IC4.2 21.49,64.92 | 18.08,61.51 18.08,61.34 IC1.20
  Top 0.254: C24.+ 27.05,59.18 28.13,60.26 29.02,60.26 29.72,59.57 29.72,58.7 37.74,58.7 39.54,56.9 v40.01,56.9 | R6.1 36.74,55.84 v35.43,57.15 28.96,57.15 27.05,55.25 | IC2.20 18.33,50.89 v18.29,50.93 | v18.03,54.86 22.73,54.86 24,53.59 26.35,53.59 26.74,53.99 26.74,54.05 27.05,54.36 27.05,55.25 | 27.05,55.25 27.05,55.46 R4.1 | v33.66,45.34 33.66,47.83 34.89,49.06 35.46,49.06 IC3.20 35.67,49.28 36.96,49.28 37.97,48.26 v39.62,48.26 | v33.58,43.1 32.39,41.91 R5.1 | C19.1 41.02,47.41 v41.02,48.13
  Top 0.305: v66.42,67.06 64.32,64.95 v64.32,64.83
  Top 1.016: IC4.2 v24.11,64.92 26.04,62.99 C24.+
  Bottom 0.152: v41.66,69.21 v43.05,67.82 43.05,66.81 42.19,65.94 42.19,63.96 41.63,63.4 41.63,62.64 43.03,61.24 43.03,60.96 43.46,60.53 43.92,60.53 44.1,60.71 46.46,60.71 | v27.56,74.8 27.56,72.01 v27.43,71.88 | v56.26,55.25 50.8,60.71 46.46,60.71 | v55.37,42.42 57.28,40.51 v57.99,40.51 | v60.92,37.58 61.32,37.97 v64.64,37.97 63.3,36.63 60.48,36.63 60.15,36.3 60.15,35.84 60.48,35.51 79.6,35.51 | v82.04,11.3 78.05,15.29 78.05,22.13 84.02,28.09 84.02,31.09 79.6,35.51 | 79.6,35.51 77.98,37.13 v77.98,45.47 78.49,45.97 v78.49,52.96 v78.49,60.83 75.44,63.88 75.44,68.99 72.68,71.75 v56.26,71.75 | v33.58,43.1 35.43,41.25 37.16,41.25 39.04,39.37 v41.15,39.37 v47.5,39.37 | v35.05,36.32 35.43,35.94 v37.97,35.94 | v46.48,60.73 46.46,60.71
  Bottom 0.254: v40.01,56.9 39.75,57.15 v35.43,57.15 | v18.29,50.93 18.03,51.18 v18.03,54.86 | v33.66,45.34 33.66,43.18 v33.58,43.1 | v41.02,48.13 40.89,48.26 v39.62,48.26
  Bottom 0.305: v24.11,64.92 24.93,65.75 24.93,65.99 25.58,66.64 29.67,66.64 35.36,72.33 35.36,74.49 37.7,76.83 46.48,76.83 v51.69,71.62 55.44,67.87 61.27,67.87 v64.32,64.83 65.35,63.79 | 65.35,63.79 69.85,63.79 69.85,62.48 SJ3.1 | 69.72,66.75 SJ1.1 66.8,67.44 v66.42,67.06 | SJ5.1 65.35,61.65 | 65.35,61.65 65.35,63.79 | SJ7.1 65.35,56.57 65.35,61.65
+5V  (via drill 0.25)
  Top 0.152: v42.18,67.8 41.82,67.8 40.64,66.62 36.65,66.62 SV1.9 SV1.10 | v40.89,68.33 37.72,71.5 37.72,72.58 38.38,73.24 38.38,74.33 37.61,75.11 29.53,75.11 25.92,71.5 16,71.5 14.71,72.79 J2.1 16.34,73.79 17.66,72.47 26.46,72.47 27,73 27,75.03 27.68,75.72 37.86,75.72 38.99,74.59 38.99,73.49 40.02,72.47 48.09,72.47 49.41,73.79 J13.1 52.3,75.03 53.34,76.07 72.11,76.07 | J27.1 72.11,76.07 | 72.11,76.07 92.48,76.07 J11.1 99.24,69.31 99.24,38.36 97.18,36.29 J25.1
  Bottom 0.152: v42.18,67.8 41.42,67.8 v40.89,68.33
  Bottom 0.305: J13.1 55.1,70.99 64.52,70.99 | 64.52,70.99 65.79,69.72 65.79,66.42 67.31,64.9 SJ2.1 | SJ4.1 70.36,60.45 70.36,60.74 70.87,61.25 71.96,61.25 75.06,64.35 | 75.06,64.35 75.06,68.83 72.9,70.99 64.52,70.99 | SJ6.1 70.36,55.37 70.36,55.66 70.87,56.17 71.96,56.17 75.06,59.27 | 75.06,59.27 75.06,59.44 75.06,64.35 | SJ8.1 70.36,50.29 70.36,50.58 70.87,51.09 71.96,51.09 75.06,54.19 75.06,59.27
  Bottom 0.508: 5.71,21.34 5.71,64.79 5.97,65.05 7.45,65.05 8.1,65.7 8.1,67.18 J2.1 | 5.71,21.34 6.6,20.45 U$1.4 | U$1.2 5.71,19.18 5.71,21.34
+12V  (via drill 0.25)
  Top 0.152: IC3.13 IC3.14 36.83,44.13 v36.83,44.11 | v23.24,61.34 23.57,61.67 23.57,63.22 23.9,63.55 24.36,63.55 24.69,63.22 24.69,62.94 v24.89,62.73 | v34.8,42.8 34.42,42.8 v33.66,42.04 | v32.26,43.43 31.37,44.32 31.24,44.32 | IC2.14 IC2.13 23.33,49.15 v23.7,49.15 | v26.8,44.7 v23.37,44.7 | v25.02,43.35 25.87,43.35 26.92,42.29 | IC1.13 22.99,60 v23.62,60
  Top 0.254: IC1.13 IC1.14
  Top 0.508: IC1.24 15.01,60.1 14.55,60.1 13.01,61.64 13.01,61.85 | 13.01,61.85 13.01,68.51 | IC3.24 35.59,51.79 33.84,51.79 32.41,50.37 32.41,45.49 31.24,44.32 30.23,43.31 27.94,43.31 26.92,42.29 24.64,40.01 20.96,40.01 v19.81,38.86 | v16.51,38.86 14.99,38.86 13.01,40.84 13.01,43.99 v14.61,45.59 | v15.37,47.88 15.73,48.24 IC2.24 | v11.43,60.96 12.32,61.85 13.01,61.85
  Top 0.61: v19.81,38.86 20.19,38.86 21.82,37.24 21.82,35.74 22.28,35.28 23.77,35.28 K1.S
  Top 1.016: J1.1 13.01,68.51 14.05,67.46 16.54,67.46 16.8,67.21 IC4.3 24.36,67.21 C25.+
  Bottom 0.152: v24.89,62.73 26.04,63.75 C25.+ | v36.83,44.11 35.52,42.8 v34.8,42.8 | v33.66,42.04 v32.26,43.43 | v23.7,49.15 26.8,46.05 v26.8,44.7 | v23.37,44.7 24.73,43.35 v25.02,43.35 | v23.62,60 23.24,60.38 v23.24,61.34
  Bottom 0.508: v19.81,38.86 v16.51,38.86 16.15,39.22 13.82,39.22 10.85,42.19 9.06,42.19 8.1,43.15 8.1,48.98 8.94,49.81 10.36,49.81 11.43,50.88 v11.43,60.96 | v14.61,45.59 14.61,47.12 v15.37,47.88
FLOW1  (via drill 0.25)
  Top 0.152: J25.2 86.23,11.38 86.23,12.95 86.16,13.03 86.16,35.56 85.34,36.37 69.95,36.37 66.32,40.01 59.56,40.01 v57.66,41.91 | v57.91,44.83 57.09,44.83 57.02,44.76 56.55,44.76 U$2.33
  Bottom 0.152: v57.66,41.91 57.91,42.16 v57.91,44.83
FLOW2  (via drill 0.25)
  Top 0.152: J27.2 72.69,68.58 65.15,68.58 63.12,66.55 63.12,55.68 62.05,54.61 62.05,48.01 59.69,45.64 v57.99,45.64 | v54.1,43.94 53.21,44.83 53.21,45.29 53,45.51 52.74,45.51 52.55,45.31 U$2.28
  Bottom 0.152: v54.1,43.94 56.29,43.94 57.35,45.01 57.35,45.06 57.68,45.39 57.73,45.39 v57.99,45.64
GND  (via drill 0.35)
  Top 0.152: R1.1 66.21,44.36 66.73,44.89 67.44,44.89 | 67.44,44.89 U$3.3 | U$3.2 67.44,45.41 67.44,44.89 | R3.1 67.45,60.87 U$7.3 U$7.2 | R2.1 66.21,51.98 66.73,52.51 U$6.3 U$6.2 | C15.2 53.51,41.78 53.72,41.78 54.05,42.11 U$2.31 | C17.2 47.55,42.18 U$2.18 | C19.2 43.47,47.21 44.07,46.61 45.15,46.61 U$2.12 | C14.2 57.62,51.35 57.28,51.69 56.48,51.69 U$2.47 | U$2.63 47.55,54.96 C13.2 C16.2
  other vias: 95.38,6.6 26.29,35.69 23.11,32.39 37.34,25.91 20.19,44.45 26.16,48.26 30.23,45.59 30.61,55.37 38.35,68.33 31.62,71.37 49.66,69.72 49.15,67.44 62.36,69.34 77.98,68.33 83.57,59.94 83.57,51.69 83.44,47.37 77.09,47.37 74.17,41.28 66.55,38.61 45.34,36.32 33.53,36.7 26.42,27.94 30.48,23.88 38.35,17.91 46.1,6.35 38.61,6.48 32.26,6.22 27.43,8.51 23.11,10.29 19.18,10.41 15.75,10.03 12.19,10.03 9.14,10.54 2.79,18.67 16.38,37.59 53.98,25.53 72.14,23.88 64.01,48.01 64.13,55.12 57.91,49.53 67.69,66.55 61.09,48.39 56.13,54.1 50.8,51.18 53.98,47.88 48.01,47.88 64.13,11.81 22.48,47.75 25.27,46.48 24,42.93 14.86,41.78 21.59,38.99 38.48,44.45 33.66,49.28 30.23,48.51 28.19,54.61 86.36,41.66 15.75,50.93 21.97,51.05 19.43,51.05 23.62,52.58 22.48,55.75 22.1,57.4 32.13,62.99 17.53,63.12 11.3,63.37 25.15,69.47 29.34,60.96 19.56,62.48 40.64,58.17 32.26,65.79 34.04,62.1 30.73,62.1 30.35,59.82 44.45,67.56 41.66,64.26 41.91,48.13 53.72,41.66 54.99,45.85 47.37,59.44 45.85,59.31 61.09,57.02 52.83,57.53 25.4,10.41 55.12,57.79 55.12,51.18 37.21,64.26 34.42,64.39 35.69,43.94 73.91,67.69 72.39,69.6 65.02,67.06 28.57,69.47 36.32,72.01 7.87,26.92 41.4,71.12 44.32,64.39 68.45,62.99 66.29,57.4 73.91,59.31 68.83,61.09 49.78,75.95 30.73,66.42 39.24,59.56 26.16,54.23 14.22,33.02 16.13,32 18.29,36.07 18.29,37.59 31.88,40.13 63.88,57.53 61.47,46.61 38.48,35.05 60.2,42.16 60.33,38.99 55.88,43.05
  pour Top: 0,0.25 0,78.74 100.71,78.49 100.71,0
  pour Bottom: 0,0.25 0,78.74 100.71,78.49 100.71,0
GROUND_SENSE  (via drill 0.25)
  Top 0.152: J24.2 79.07,9.11 R11.2 81.24,12.19 85.47,12.19 85.85,12.57 85.85,35.43 85.22,36.07 v69.47,36.07 | v60.71,36.07 49.28,36.07 v43.05,42.29 | v44.19,44.83 44.45,45.09 44.45,45.38 44.7,45.64 U$2.14
  Bottom 0.152: v69.47,36.07 v60.71,36.07 | v43.05,42.29 42.65,42.69 41.81,42.69 38.12,46.38 38.12,46.84 38.71,47.42 39.73,47.42 42.32,44.83 v44.19,44.83
M1_AIN1  (via drill 0.25)
  Top 0.152: U$2.55 51.43,53.89 51.43,53.42 49.04,51.03 48.95,51.03 v48.64,50.72 | v17.4,61.34 17.43,61.32 IC1.21
  Bottom 0.152: v17.4,61.34 15.14,61.34 15.09,61.39 14.63,61.39 14.3,61.06 14.3,59.95 23.52,50.72 v48.64,50.72
M1_AIN2  (via drill 0.25)
  Top 0.152: U$2.56 50.93,53.89 50.93,53.39 48.87,51.33 48.41,51.33 48.4,51.34 v48.04,51.34 | IC1.22 16.55,59.85 16.55,60.35 16.07,60.83 v14.86,60.83 | v31.75,56.52 29.21,56.52 v28.32,55.63
  Bottom 0.152: v48.04,51.34 41.5,57.88 41.23,58.15 41.17,58.21 41.17,58.39 40.76,58.8 35.56,58.8 34.91,58.15 33.39,58.15 v31.75,56.52 | v14.86,60.83 14.86,59.82 16.52,58.15 25.79,58.15 v28.32,55.63
M1_BIN1  (via drill 0.25, 0.35)
  Top 0.152: v48.64,51.89 49.15,52.4 49.41,52.4 50.55,53.54 U$2.57 | IC1.17 19.94,59.72 v19.94,61.34 22.34,61.34 22.8,61.79 22.8,62.26 v23.02,62.48 | v30.73,64.26 31.45,64.26 31.93,64.74 32.33,64.74 32.69,64.39 32.69,62.79 32,62.1 v32,61.34 | v29.21,62.87 28.96,62.87 v28.07,63.75
  Bottom 0.152: v48.64,51.89 41.12,59.41 40.39,59.41 39.53,60.27 33.34,60.27 33.24,60.18 32.8,60.18 32.49,60.49 32.49,60.86 v32,61.34 | 20.47,60.27 20.14,60.6 20.14,61.14 v19.94,61.34 | v30.73,64.26 30.61,64.26 v29.21,62.87 | v23.02,62.48 24.46,62.48 24.7,62.25 25.09,62.25 26.6,63.75 v28.07,63.75
M1_BIN2  (via drill 0.25, 0.35)
  Top 0.152: U$2.58 49.93,53.89 49.93,53.42 49.22,52.71 v48.64,52.71 | IC1.16 20.7,59.66 v20.7,60.83 23.63,60.83 23.72,60.92 23.97,60.92 24.06,60.83 24.64,60.83 v24.77,60.71 | v33.02,60.71 31.12,60.71 v30.73,61.09
  Bottom 0.152: v48.64,52.71 41.63,59.72 40.52,59.72 39.4,60.83 33.15,60.83 v33.02,60.71 | v24.77,60.71 28.84,60.71 29.12,60.43 30.08,60.43 v30.73,61.09
M1_PWMA  (via drill 0.25)
  Top 0.152: U$2.41 46.36,48.64 45.9,49.09 45.9,52.38 45.77,52.52 44.32,52.52 v44.07,52.26 | IC1.23 16.12,58.55 16.92,57.76 19.7,57.76 20.72,56.75 22.69,56.75 24.72,54.72 25.91,54.72 26.04,54.85 26.04,56.14 27.75,57.85 29.13,57.85 29.32,58.04 37.47,58.04 38.48,57.02 38.48,55.25 41.21,52.52 v41.23,52.53
  Bottom 0.152: v41.23,52.53 41.49,52.26 v44.07,52.26
M1_PWMB
  Top 0.152: U$2.42 46.62,49.14 46.21,49.55 46.21,52.51 45.9,52.82 43.12,52.82 37.59,58.34 29.19,58.34 29,58.15 25.61,58.15 25.01,58.76 25.01,59.32 23.84,60.49 21.68,60.49 21.55,60.35 21.55,59.85 IC1.15
M2_AIN1  (via drill 0.25, 0.35)
  Top 0.152: U$2.59 49.43,53.89 49.43,53.42 49.3,53.28 46.8,53.28 46.08,54.01 45.91,54.01 44.48,55.44 44.48,59.09 v44.7,59.31 | v32.13,64.26 31.24,63.37 v30.73,63.37 | v23.37,69.21 22.99,69.6 v14.61,69.6 | v12.32,48.01 13.72,48.01 14.43,47.3 14.43,47.12 16.52,45.03 16.69,45.03 v17.27,44.45 | v18.6,46.91 18.6,47.7 17.68,48.62 IC2.21 | v24.26,61.34 24.13,61.47 v24.13,62.99
  Bottom 0.152: v32.13,64.26 33.3,65.43 33.3,67.36 34.31,68.38 34.77,68.38 35.1,68.05 35.1,67.64 35.31,67.44 36.58,67.44 36.58,62.23 37.08,61.72 42.12,61.72 42.72,61.12 42.72,60.48 v43.43,59.77 44.24,59.77 v44.7,59.31 | v30.73,63.37 28.7,61.34 v24.26,61.34 | v24.13,62.99 23.37,63.75 v23.37,69.21 | v14.61,69.6 12.32,67.31 12.32,51.08 10.56,49.33 9.14,49.33 8.59,48.78 8.59,45.46 9.14,44.91 9.68,44.91 10.62,43.97 10.62,43.2 10.95,42.88 11.41,42.88 12.5,43.97 12.5,46.59 12.32,46.76 v12.32,48.01 | v17.27,44.45 17.27,45.59 v18.6,46.91
M2_AIN2  (via drill 0.25)
  Top 0.152: v16.62,46.85 16.98,46.85 17.78,46.05 22.61,46.05 24.56,48.01 24.56,51.38 25.53,52.35 38.41,52.35 39.17,51.58 40.01,51.58 40.37,51.94 40.37,52.1 40.62,52.35 41.45,51.51 v41.45,51.28 41.68,51.28 44.33,48.64 U$2.8 | v17.91,47.37 17.03,48.25 IC2.22
  Bottom 0.152: v16.62,46.85 17.38,46.85 v17.91,47.37
M2_BIN1  (via drill 0.25)
  Top 0.152: U$2.9 44.04,48.14 v42.02,50.15 | v20.45,47.88 20.45,49.43 IC2.17
  Bottom 0.152: v42.02,50.15 41.76,50.42 23.5,50.42 20.96,47.88 v20.45,47.88
M2_BIN2  (via drill 0.25)
  Top 0.152: U$2.10 44.11,47.64 42.41,49.34 v42.04,49.34 | IC2.16 20.93,51.16 v20.96,51.18
  Bottom 0.152: v42.04,49.34 41.26,50.11 23.62,50.11 20.83,47.32 20.22,47.32 19.89,47.65 19.89,50.11 v20.96,51.18
M2_PWMA  (via drill 0.35)
  Top 0.152: U$2.43 46.79,49.64 46.51,49.91 46.51,52.63 46.02,53.12 44.45,53.12 44.15,53.43 v43.56,53.43 | v39.76,52.19 39,52.19 38.53,52.65 25.4,52.65 24.26,51.51 24.26,48.13 22.48,46.36 17.91,46.36 16.38,47.88 IC2.23
  Bottom 0.152: v43.56,53.43 41,53.43 v39.76,52.19
M2_PWMB  (via drill 0.25, 0.35)
  Top 0.152: U$2.44 56.4,50.16 46.86,50.16 46.82,50.21 46.82,52.76 46.15,53.43 44.58,53.43 43.81,54.19 v43.81,54.34 | v39.24,52.96 25.27,52.96 22.77,50.45 21.93,50.45 21.65,50.16 21.46,50.16 21.46,49.72 IC2.15 | v42.29,52.83 41.77,52.83 v40.63,53.97
  Bottom 0.152: v43.81,54.34 43.81,54.03 44.17,53.68 44.17,53.18 43.81,52.82 43.31,52.82 43.3,52.83 v42.29,52.83 | v40.63,53.97 40.25,53.97 v39.24,52.96
M3_AIN1  (via drill 0.25)
  Top 0.152: U$2.11 46.12,47.14 v46.61,47.62 | v38.23,49.55 37.9,49.89 IC3.21
  Bottom 0.152: v46.61,47.62 44.68,49.55 43.05,49.55 42.27,48.78 41.81,48.78 41.03,49.55 v38.23,49.55
M3_AIN2  (via drill 0.25)
  Top 0.152: U$2.22 49.43,42.88 49.43,43.36 49.35,43.43 v49.35,44.07 | IC3.22 33.26,50.54 32.89,50.16 32.89,44.58 33.92,43.55 35.33,43.55 35.47,43.41 35.91,43.41 36.05,43.55 v42.28,43.55
  Bottom 0.152: v49.35,44.07 48.85,43.56 46.38,43.56 46.33,43.61 42.34,43.61 v42.28,43.55
M3_BIN1  (via drill 0.25)
  Top 0.152: U$2.23 50.05,43.95 v50.17,44.07 | v39.5,46.86 39.08,47.29 IC3.17
  Bottom 0.152: v50.17,44.07 50.15,44.07 49.59,44.63 49.12,44.63 48.8,44.3 48.8,44.02 48.64,43.87 46.51,43.87 46.26,44.11 42.25,44.11 v39.5,46.86
M3_BIN2  (via drill 0.25)
  Top 0.152: v38.68,46.61 38.66,46.64 IC3.16 | v51.99,44.45 51.73,44.2 51.73,43.55 51.55,43.37 U$2.26
  Bottom 0.152: v38.68,46.61 41.72,43.57 41.72,43.32 42.05,42.99 42.52,42.99 42.83,43.31 45.34,43.31 45.54,43.1 45.54,42.33 47.28,40.59 47.88,40.59 51.16,40.59 53.14,42.96 53.14,44.17 52.82,44.49 52.03,44.49 v51.99,44.45
M3_PWMA  (via drill 0.25)
  Top 0.152: 53.05,43.47 U$2.29 52.93,42.64 52.93,42.17 52.67,41.91 51.44,41.91 v51.44,41.79 v51.43,41.78 | v46.1,43.05 44.9,44.26 42.8,44.26 40.26,46.8 40.26,49.91 38.98,51.19 IC3.23
  Bottom 0.152: 51.7,43.05 51.69,43.05 | 51.69,43.05 v46.1,43.05 | v51.43,41.78 51.69,42.04 51.69,43.05
M3_PWMB  (via drill 0.25)
  Top 0.152: U$2.30 53.43,42.64 53.43,42.17 52.79,41.53 51.97,41.53 51.66,41.22 51.2,41.22 50.89,41.53 v50.55,41.53 | v46.42,42.24 46.16,42.49 44.13,42.49 40.64,45.98 IC3.15
  Bottom 0.152: v46.42,42.24 46.92,42.75 49.71,42.75 50.55,41.91 v50.55,41.53
N$1  (via drill 0.25)
  Top 0.152: v11.56,30.48 11.43,30.35 v11.43,28.57
  Bottom 0.152: SJ9.1 SJ10.1 13.08,32.95 12.27,32.14 12.27,31.19 v11.56,30.48 | U$1.8 8.38,25.53 8.59,25.73 8.59,25.92 9.14,26.47 9.32,26.47 v11.43,28.57
N$2
  Bottom 0.508: K1.P 29.59,9.27 48.54,9.27 J4.1
N$3
  Bottom 0.508: K2.P 45.21,11.43 52.83,11.43 60.33,3.94 J7.1
N$4
  Top 0.152: U$4.P$1 37.05,36.83 36.42,37.46 36.42,40.05 36.08,40.39 34.79,40.39 32.39,37.99 32.39,20.32 K1.1
N$5
  Top 0.152: U$4.P$4 47.24,25.22 K2.1
N$6
  Top 0.152: U$3.8 72.05,46.19 71.34,46.9 C1.1 | U$3.8 72.81,46.79 C2.2 | U$3.8 74.95,46.19 74.97,46.21 75.69,46.21 76.16,46.21 89.38,46.21 J6.2
  Top 0.61: C1.1 C2.2
N$7
  Top 0.152: 67.31,46.19 U$3.1 67.85,46.48 69.22,46.48 69.63,46.9 C1.2 70.36,48.48 90.61,48.48 J6.1 | 67.31,46.19 65.53,46.19 R1.2 | C3.1 66.46,47.04 67.31,46.19
  Top 0.61: R1.2 65.41,47.12 66.04,47.75 C3.1
N$8
  Bottom 0.508: K3.P 67.84,6.58 J9.1
N$9
  Top 0.152: K3.1 65.02,26.88 66.24,28.09 66.24,32.26 U$5.P$4
N$10
  Top 0.152: 72.81,54.41 71.34,55.88 C5.1 | U$6.8 73.39,53.83 | 73.39,53.83 72.81,54.41 | 72.81,54.41 C6.2 | 73.39,53.83 74.02,54.46 75.95,54.46 76.16,54.46 88.11,54.46 J3.2
  Top 0.61: C5.1 C6.2
N$11
  Top 0.152: U$6.1 67.44,53.68 R2.2 | U$6.1 66.46,54.91 C7.1 | U$6.1 69.63,55.88 C5.2 70.27,56.64 70.6,56.64 70.69,56.74 75.56,56.74 76,56.74 89.34,56.74 J3.1
  Top 0.61: R2.2 65.41,54.95 C7.1
N$12
  Top 0.152: C10.2 73.41,63.66 U$7.8 74.06,62.72 75.44,62.72 76.16,62.72 86.84,62.72 J5.2
  Top 0.61: C9.1 C10.2
N$13
  Top 0.152: U$7.1 67.05,62.57 R3.2 | U$7.1 67.56,62.74 66.25,64.05 C11.1 | 75.29,64.43 75.29,64.86 75.16,64.99 | 75.16,64.99 70.69,64.99 70.6,64.9 70.27,64.9 C9.2 69.63,62.27 69.43,62.06 U$7.1 | J5.1 88.07,64.99 75.16,64.99
  Top 0.61: R3.2 65.41,63.21 66.25,64.05
N$14  (via drill 0.25)
  Top 0.254: v10.41,44.96 10.69,44.68 10.69,43.81 10.57,43.69 10.57,43.18 10.69,43.06 J15.1 | v12.19,50.16 12.19,50.55 11.96,50.78 11.96,53.87 12.57,54.48 14.86,54.48 15.49,53.85 15.47,53.83 IC1.1 IC1.2
  Bottom 0.254: v10.41,44.96 10.41,45.34 10.52,45.44 10.52,48.49 v12.19,50.16
N$15  (via drill 0.25)
  Top 0.254: J16.1 17.68,11.79 15.24,14.22 15.24,24 18.16,24 v19.18,25.02 | IC1.4 IC1.3 16.77,51.3 v17.14,50.93 | v30.26,36.23 v28.7,34.67
  Bottom 0.254: v17.14,50.93 17.14,49.78 17.14,49.66 17.14,48.23 16.01,47.1 16.01,44.85 17.02,43.84 17.52,43.84 17.88,44.2 17.88,44.76 19.43,46.3 | v30.26,36.23 30.26,36.54 28.98,37.82 28.98,40.64 23.32,46.3 19.43,46.3 | 19.3,46.3 19.43,46.3 | v28.7,34.67 19.18,25.15 v19.18,25.02
N$16
  Bottom 0.508: K4.P 76.84,12.95 74.93,11.05 74.93,4.04 J10.1
N$17
  Top 0.152: U$5.P$1 69.65,30.56 69.65,28.09 70.36,27.38 72.82,27.38 K4.1
N$18  (via drill 0.25)
  Top 0.254: IC1.6 IC1.5 18.08,52.95 17.74,53.29 17.48,53.29 v17.22,53.54 | v15.44,58.01 15.24,57.81 11.39,57.81 10.58,57 9.12,57 8.53,56.42 8.53,18.05 7.19,16.71 J15.2
  Bottom 0.254: v15.44,58.01 17.09,56.36 17.27,56.36 17.63,56.01 17.63,55.5 17.22,55.1 v17.22,53.54
N$19  (via drill 0.25)
  Top 0.254: J17.2 21.16,23.92 17.76,27.33 17,27.33 14.74,29.59 11.84,32.49 v11.84,44.48 | v11.94,46.36 11.94,47.24 10.95,48.23 10.95,56.22 11.73,57 14.63,57 17.65,53.98 19.18,53.98 19.38,53.78 IC1.7 IC1.8
  Bottom 0.254: v11.84,44.48 11.84,46.26 v11.94,46.36
N$20  (via drill 0.25)
  Top 0.254: J16.2 14.18,29.58 11.43,32.32 11.43,43.18 v11.18,43.43 | v11.56,48.64 11.56,56.13 12.01,56.59 14.46,56.59 15.88,55.18 v15.88,54.74 | v17.02,55.75 19.94,55.75 v20.19,55.5 | v20.96,54.23 20.96,52.75 IC1.10 IC1.9
  Bottom 0.254: v11.18,43.43 11.18,48.26 v11.56,48.64 | v15.88,54.74 16.89,55.75 v17.02,55.75 | v20.19,55.5 20.96,54.74 v20.96,54.23
N$21  (via drill 0.25)
  Top 0.254: J17.1 24.66,13.75 24.77,13.85 24.77,24.34 19.3,29.8 19.3,31.24 12.47,38.07 12.47,44.7 10.54,46.64 10.54,56.39 11.56,57.4 19.56,57.4 v21.34,55.63 | v21.97,54.23 IC1.11 IC1.12
  Bottom 0.254: v21.34,55.63 21.97,54.99 v21.97,54.23
N$22  (via drill 0.25)
  Top 0.152: R4.2 23.5,57.32 v23.5,59.31 | v19.13,61.09 18.73,60.69 IC1.19
  Bottom 0.152: v23.5,59.31 19.94,59.31 19.13,60.12 v19.13,61.09
N$24
  Top 0.254: J18.1 30.72,3.94 29.35,2.57 28.21,2.57 26.11,4.67 26.11,23.57 19.71,29.97 19.71,31.4 17.25,33.87 17.25,40.91 16.55,41.61 16.55,42.18 16.47,42.25 IC2.2
  Top 0.305: IC2.1 15.82,42.25 16.47,42.25
N$25
  Top 0.254: IC2.3 IC2.4 17.68,36.86 | 17.68,36.86 17.65,36.83 | 17.68,36.86 17.68,34.01 27.38,24.31 27.38,24 27.38,15.55 28.6,14.33 28.88,14.33 J19.1
N$26  (via drill 0.25)
  Top 0.254: IC2.5 IC2.6 18.98,37.01 | 18.98,37.01 18.92,36.96 | 18.98,37.01 18.98,33.85 v20.45,32.39 | J18.2 28.78,13 26.52,15.26 26.52,24.03 v20.32,30.23
  Bottom 0.254: v20.45,32.39 20.45,30.35 v20.32,30.23
N$27  (via drill 0.25)
  Top 0.254: J20.2 31.96,14.73 28.77,14.73 27.79,15.71 27.79,24.13 27.79,24.3 27.79,24.42 31.37,28.01 31.37,38.23 29.72,39.88 v27.43,39.88 | v23.88,41.28 20.78,41.28 20.45,41.61 20.45,42.18 IC2.8 IC2.7
  Bottom 0.254: v27.43,39.88 26.04,41.28 v23.88,41.28
N$28  (via drill 0.25)
  Top 0.254: v27.55,43.96 22.62,43.96 21.75,43.09 21.75,42.52 IC2.10 IC2.9 | J19.2 38.48,1.23 48.13,1.21 48.13,15.5 48.51,15.88 48.51,24.46 39.12,33.86 v39.12,38.79
  Bottom 0.254: v27.55,43.96 30.09,43.96 33.15,40.89 37.01,40.89 v39.12,38.79
N$29  (via drill 0.25)
  Top 0.254: J20.1 35.05,15.14 28.94,15.14 28.19,15.88 28.19,24.14 32,28.07 31.88,38.84 29.7,41.02 v27.43,41.02 | v25.15,42.16 23.06,42.16 IC2.12 IC2.11
  Bottom 0.254: v27.43,41.02 26.29,42.16 v25.15,42.16
N$30  (via drill 0.25)
  Top 0.152: R5.2 28.57,41.91 v28.45,42.04 | v19.56,46.91 18.98,47.49 IC2.19
  Bottom 0.152: v28.45,42.04 23.57,46.91 v19.56,46.91
N$32  (via drill 0.25)
  Top 0.254: J21.1 30.08,60.6 30.39,60.6 30.93,60.06 30.93,59.77 31.12,59.59 | v40.55,56.17 40.55,56.58 40.62,56.64 40.62,57.15 38.17,59.59 31.12,59.59 | v30.35,51.79 28.42,51.79 IC3.1 IC3.2 | 31.12,59.59 31.09,59.59
  Bottom 0.254: v40.55,56.17 34.74,56.17 v30.35,51.79
N$33  (via drill 0.25)
  Top 0.254: J22.1 37.06,70.34 v34.54,67.82 | v42.16,60.88 42.16,55.25 v42.04,55.12 | v31.12,51.31 30.73,51.31 30.13,50.71 28.55,50.71 IC3.3 IC3.4
  Bottom 0.254: v34.54,67.82 33.66,66.93 33.66,63.42 35.89,61.19 40.83,61.19 41.14,60.88 v42.16,60.88 | v42.04,55.12 41.63,55.12 41.53,55.02 41.02,55.02 40.92,55.12 35.43,55.12 32.36,52.05 31.75,52.05 31.39,51.69 31.39,51.59 v31.12,51.31
N$34  (via drill 0.25)
  Top 0.254: J21.2 33.58,67.1 33.05,66.57 33.05,62.13 v32.77,61.85 | v34.54,61.39 34.95,60.98 39.5,60.98 41.04,60.98 41.42,60.6 41.42,60.05 41.27,59.9 41.27,58.17 v41.27,55.63 | v34.03,54.61 32.94,53.52 v28.32,53.52 | v26.67,51.69 26.67,49.91 27.35,49.23 IC3.5 IC3.6
  Bottom 0.254: v32.77,61.85 33.22,61.39 v34.54,61.39 | v34.03,54.61 35.05,55.63 40.24,55.63 40.3,55.56 40.8,55.56 40.87,55.63 v41.27,55.63 | v28.32,53.52 26.67,51.87 v26.67,51.69
N$35  (via drill 0.25)
  Top 0.152: IC3.7 28.16,48.16 27.66,48.16 25.86,49.96 v25.86,51.69 | v24.77,57.53 24.38,57.91 v24.38,59.05
  Top 0.254: IC3.7 IC3.8
  Bottom 0.152: J23.2 45.91,73.79 44.59,75.11 40.02,75.11 39.24,74.33 39.24,73.91 27.23,61.9 19.15,61.9 18.57,61.32 18.57,60.25 20.07,58.75 23.73,58.75 24.03,59.05 v24.38,59.05 | v25.86,51.69 25.6,51.94 25.6,56.69 v24.77,57.53
N$36  (via drill 0.25)
  Top 0.254: IC3.10 IC3.9 29.74,46.64 30.35,47.24 v31.62,47.24 | v40.64,51.31 40.82,51.13 v40.82,48.95 | v43.69,61.09 42.8,60.2 v42.8,55.5
  Bottom 0.254: J22.2 48.13,66.22 48.13,61.72 47.21,61.72 47.03,61.9 44.5,61.9 v43.69,61.09 | v42.8,55.5 42.8,54.99 42.77,54.99 42.29,54.51 40.96,54.51 40.75,54.71 36.2,54.71 36.2,53.09 37.97,51.31 v40.64,51.31 | v40.82,48.95 38.91,48.95 37.21,47.24 v31.62,47.24
N$37  (via drill 0.25)
  Top 0.152: IC3.11 16.64,45.34 14.73,47.24 v14.73,49.53 | v15.93,56.57 19.1,56.57 v19.18,56.64 | v31.37,64.9 31.37,67.44 v32.39,68.45 | v43.31,76.2 43.31,74.53 J23.1
  Top 0.254: IC3.11 IC3.12
  Bottom 0.152: v14.73,49.53 14.73,55.37 v15.93,56.57 | v19.18,56.64 25.22,56.64 25.3,56.57 25.3,51.46 25.63,51.13 26.9,51.13 28.88,53.11 28.88,57.42 28.15,58.15 | v32.39,68.45 35.74,71.81 35.74,74.33 37.61,76.2 v43.31,76.2 | 28.15,58.15 27.55,58.76 27.55,59.61 27.69,59.75 27.69,60.07 | 28.15,58.15 29.44,58.15 31.37,60.08 v31.37,64.9
N$38  (via drill 0.25)
  Top 0.152: R6.2 36.54,53.59 v35.43,53.59 | v36.96,48.13 36.51,48.59 IC3.19 | v31.62,49.02 31.62,50.8 v32.13,51.31
  Bottom 0.152: v35.43,53.59 33.27,51.44 32.26,51.44 v32.13,51.31 | v31.62,49.02 32.51,48.13 v36.96,48.13
N$40
  Top 0.152: R7.1 36.86,39.06 36.86,37.59 36.99,37.45 37.22,37.45 U$4.P$2
N$41
  Top 0.152: R8.1 35.43,38.48 35.7,38.21 35.98,38.21 36.12,38.08 36.12,37.59 35.98,37.45 35.76,37.45 U$4.P$5
N$42
  Top 0.152: R9.1 62.41,38.6 62.41,37.33 62.27,37.2 62.01,37.2 61.93,37.11 U$5.P$5
N$43
  Top 0.152: R10.1 63.75,37.97 63.74,37.96 63.28,37.96 63.15,37.82 63.15,37.33 63.4,37.08 U$5.P$2
N$44  (via drill 0.25)
  Top 0.305: JP1.2 62.74,66.17 62.74,66.71 65.63,69.6 v67.94,69.6
  Bottom 0.305: v67.94,69.6 69.38,69.6 70.61,68.36 70.61,68.07 SJ1.2 SJ2.2
N$45  (via drill 0.25)
  Top 0.305: v68.33,70.36 68.2,70.23 65.62,70.23 62.28,66.89 62.28,66.36 61.25,65.33 60.39,65.33 59.32,64.26 JP2.2 | v72.26,59.36 71.99,59.63 66.83,59.63 66.4,60.07 64.73,60.07 64.55,60.25 64.55,63.83 66.09,65.37 71.42,65.37 v72.59,66.55
  Bottom 0.305: v68.33,70.36 68.64,70.05 70.45,70.05 72.59,67.91 v72.59,66.55 72.59,63.78 71.25,62.44 SJ3.2 | SJ4.2 71.81,59.82 v72.26,59.36
N$46  (via drill 0.25)
  Top 0.305: v66.91,58.24 67.11,58.04 v72.52,58.04 73.3,58.04 v74.04,57.29 | v66.22,59.13 63.93,59.13 v63.88,59.18
  Bottom 0.305: SJ5.2 71.75,57.28 v72.52,58.04 | v66.91,58.24 66.22,58.93 v66.22,59.13 | JP3.2 56.59,62.15 56.59,61.28 58.69,59.18 v63.88,59.18 | SJ6.2 71.48,54.74 v74.04,57.29
N$47  (via drill 0.25)
  Top 0.305: v73.28,50.42 72.39,49.53 v64.9,49.53 | v67.82,51.05 69.72,51.05 v72.14,53.47
  Bottom 0.305: SJ8.2 72.52,49.66 v73.28,50.42 | v67.82,51.05 66.42,51.05 v64.9,49.53 52.38,62.05 52.38,62.16 51.75,62.79 51.64,62.79 51.31,63.12 JP4.2 | v72.14,53.47 71.25,52.58 SJ7.2
N$48
  Bottom 0.152: SJ11.1 SJ12.1 8.13,29.21 U$1.10
NRST  (via drill 0.35)
  Top 0.152: U$2.7 45.05,49.26 44.58,49.26 43.43,50.41 v43.43,51.44 | v43.42,55.01 43.42,56.6 44.17,57.35 44.17,61.29 43.76,61.7 42.64,61.7 41.88,62.46 41.88,63.53 42.19,63.83 42.19,65.94 42.77,66.52 43.59,66.52 44.58,65.53 SV1.1
  Bottom 0.152: v43.43,51.44 43.78,51.78 44.27,51.78 44.55,52.06 44.55,54.35 44.04,54.87 43.56,54.87 v43.42,55.01
PRESSURE1
  Top 0.152: 70.33,38.38 70.23,38.48 | 70.23,38.48 65.91,42.8 56.52,42.8 55.1,41.25 55.1,40.05 54.84,39.78 50.8,39.78 48.67,42.17 48.67,42.64 U$2.20 | J12.1 98.93,62.63 98.93,38.48 70.23,38.48
PRESSURE2  (via drill 0.25, 0.35)
  Top 0.152: J14.1 56.62,68.71 42.29,68.71 40.51,66.93 33.91,66.93 33.4,66.42 33.4,61.34 34.42,60.33 v40.77,60.33 | U$2.21 49.05,43.58 48.8,43.84 48.8,44.3 49.12,44.63 49.45,44.63 v50.16,45.34
  Bottom 0.152: v50.16,45.34 50.16,46.86 49.66,47.37 49.66,58.29 47.75,60.2 44.99,60.2 44.99,59.77 45.23,59.53 45.23,59.09 44.92,58.78 44.48,58.78 44.05,59.21 43.2,59.21 42.21,60.2 40.89,60.2 v40.77,60.33
RX  (via drill 0.25)
  Top 0.152: U$2.24 50.67,42.88 50.67,43.36 50.87,43.55 v50.87,44.52 | v29.59,37.97 v22.35,37.97 22.61,37.72 v22.61,36.07
  Bottom 0.152: v50.87,44.52 50.88,44.53 50.88,46.23 51.56,46.91 58.16,46.91 58.85,46.23 58.85,38.61 58.16,37.92 29.64,37.92 v29.59,37.97 | v22.35,37.97 21.08,36.7 SJ9.2 | SJ11.2 17.73,34.37 20.27,34.37 21.97,36.07 v22.61,36.07
SERVO1
  Top 0.152: JP1.1 58.32,59.21 52.07,59.21 51.21,58.35 51.21,57 51.44,56.77 57.81,56.77 60.73,53.85 60.73,49.28 58.21,46.76 56.55,46.76 U$2.37
SERVO2
  Top 0.152: JP2.1 55.45,59.51 51.94,59.51 50.91,58.47 50.91,56.79 51.23,56.46 57.68,56.46 60.43,53.72 60.43,49.4 58.28,47.26 56.55,47.26 U$2.38
SERVO3
  Top 0.152: JP3.1 52.58,59.82 51.61,59.82 50.6,58.8 50.6,56.64 51.08,56.16 57.56,56.16 60.12,53.59 60.12,49.53 58.35,47.76 56.55,47.76 U$2.39
SERVO4
  Top 0.152: JP4.1 51.31,59.94 50.3,58.93 50.3,56.51 50.95,55.86 56.99,55.86 59.37,53.47 59.82,53.47 59.82,49.66 58.29,48.13 58.29,48.14 U$2.40
SWDCLK
  Top 0.152: U$2.49 54.55,54.67 53.98,55.25 50.7,55.25 49.69,56.26 49.69,59.03 SV1.2
SWDIO
  Top 0.152: SV1.4 44.32,62.99 45.31,63.98 46.13,63.98 46.71,63.4 46.71,62.51 49.99,59.23 49.99,56.39 50.83,55.55 54.1,55.55 54.93,54.72 54.93,53.78 55.7,53.02 55.7,51.39 55.83,51.26 56.3,51.26 U$2.46
SWIM
  Top 0.152: SV1.3 43.18,64.39 42.19,63.4 42.19,62.58 42.77,62 46.28,62 49.38,58.9 49.38,55.32 48.67,54.61 48.67,54.13 U$2.61
TEMP1  (via drill 0.25)
  Top 0.152: U$3.5 72.48,43.31 63.63,43.31 63.12,43.82 60.76,43.82 60.59,43.65 55.28,43.65 52.93,46 49.55,46 v49.15,45.59 | v47.12,46.91 45.9,45.7 45.9,45.39 45.65,45.14 U$2.15
  Top 0.61: U$3.6 U$3.5
  Bottom 0.152: v49.15,45.59 49.01,45.73 49.01,46.28 48.68,46.61 47.42,46.61 v47.12,46.91
TEMP2  (via drill 0.25)
  Top 0.152: U$6.5 71.97,50.42 63.37,50.42 62.87,49.91 62.87,46.36 60.46,43.95 55.61,43.95 55.56,44 55.47,44.02 55.35,44.02 53.06,46.3 48.39,46.3 48.39,46.12 v48.45,46.05 | v47.12,46.1 45.65,44.64 U$2.16
  Top 0.61: U$6.6 U$6.5
  Bottom 0.152: v48.45,46.05 48.4,46.1 v47.12,46.1
TEMP3
  Top 0.152: U$7.5 73.28,59.98 73.28,59.31 72.77,58.8 66.67,58.8 62.36,54.48 62.36,46.61 60.01,44.26 55.83,44.26 55.77,44.32 55.5,44.32 53.21,46.61 48.13,46.61 47.68,46.15 47.68,45.87 47.35,45.54 47.07,45.54 47.05,45.53 U$2.17 47.12,42.83
  Top 0.61: U$7.6 U$7.5
TX  (via drill 0.25)
  Top 0.152: U$2.25 51.05,43.3 51.43,43.68 51.43,45.08 v51.44,45.09 | v29.98,38.74 24.3,38.74 v24.26,38.79
  Bottom 0.152: v51.44,45.09 51.44,46.35 51.44,46.36 51.69,46.61 58.04,46.61 58.55,46.1 58.55,38.73 58.04,38.23 30.49,38.23 v29.98,38.74 | v24.26,38.79 24.17,38.7 | 24.17,38.7 20.14,34.67 SJ10.2 | 24.17,38.7 24.09,38.7 23.16,37.77 23.16,35.84 21.39,34.06 19.28,34.06 16.31,31.09 16.31,30.91 SJ12.2
V+
  Bottom 0.508: J8.2 13.74,62.33 13.74,41.17 14.37,40.54 24.91,40.54 31.41,34.04 42.8,34.04 | 42.8,34.04 K2.S | K3.S 60.58,34.04 | 60.58,34.04 57.02,34.04 42.8,34.04 | K4.S 78.36,34.04 60.58,34.04
V-
  Bottom 0.508: J8.1 13.08,65.17 13.08,40.89 14.1,39.88 24.64,39.88 32.39,32.13 32.39,20.95 | 32.39,20.95 32.39,12.19 33.4,11.18 44.53,11.18 44.94,10.77 50.52,10.77 J7.2 | J9.2 54.43,13.84 46.1,13.84 38.99,20.95 | 38.99,20.95 37.72,20.95 32.39,20.95 | J10.2 68.5,6.76 68.5,8.89 56.43,20.95 38.99,20.95
~RELAY1  (via drill 0.25)
  Top 0.152: U$2.51 53.55,52.5 v53.59,52.45 | v42.42,37.36 42.42,40.64 40.51,42.55 37.97,42.55 37.47,42.04 R7.2
  Bottom 0.152: v42.42,37.36 42.67,37.62 58.29,37.62 59.16,38.48 59.16,46.35 55.16,50.35 54.77,50.35 53.59,51.52 v53.59,52.45
~RELAY2  (via drill 0.25)
  Top 0.152: v54.41,52.58 54.41,52.66 54.15,52.4 54.15,52.22 53.83,51.89 53.36,51.89 53.04,52.22 53.04,52.68 53.05,52.7 U$2.52 | v42.85,36.65 42.7,36.8 42.19,36.8 41.86,37.13 41.86,37.6 42.11,37.85 42.11,40.51 40.39,42.24 38.99,42.24 38.24,41.5 38.24,40.77 38.11,40.63 36.82,40.63 36.09,41.36 R8.2
  Bottom 0.152: v42.85,36.65 43.52,37.31 58.42,37.31 59.46,38.36 59.46,46.48 55.29,50.65 54.9,50.65 54.41,51.14 v54.41,52.58
~RELAY3  (via drill 0.25)
  Top 0.152: U$2.53 52.67,53.89 52.67,52.15 53.24,51.59 54.21,51.59 54.78,52.16 v55.14,52.16 | v61.59,42.16 61.72,42.04 R9.2
  Bottom 0.152: v55.14,52.16 56.81,52.16 59.82,49.15 59.82,43.94 v61.59,42.16
~RELAY4  (via drill 0.25)
  Top 0.152: U$2.54 52.05,51.71 v52.32,51.44 | v63.5,42.24 63.75,41.99 R10.2
  Bottom 0.152: v63.5,42.24 60.12,45.62 60.12,49.28 56.26,53.14 53.49,53.14 53.04,52.68 53.04,52.15 v52.32,51.44

### Text on the board
tNames: 69 | + | 12V | + | 5V | Vpp | M3A0 | R1 | R2 | R3 | R4 | Vpp | Vpp | Vpp | GSense | GND | GND | F1 | F1 | 12V | +
bNames: Aaron Pabst